# Altium project MAIN_BOARD.PrjPcb (part 1 of 3)
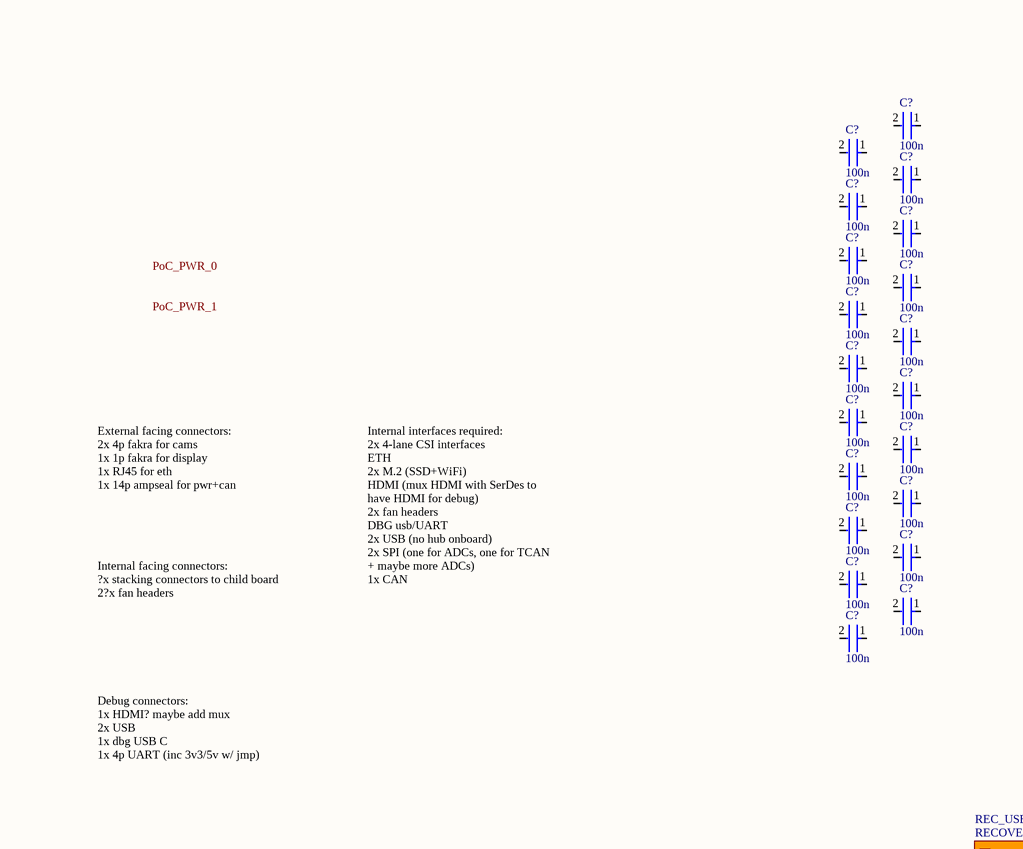
[diagram p0: MAIN_BOARD.SchDoc, top left]
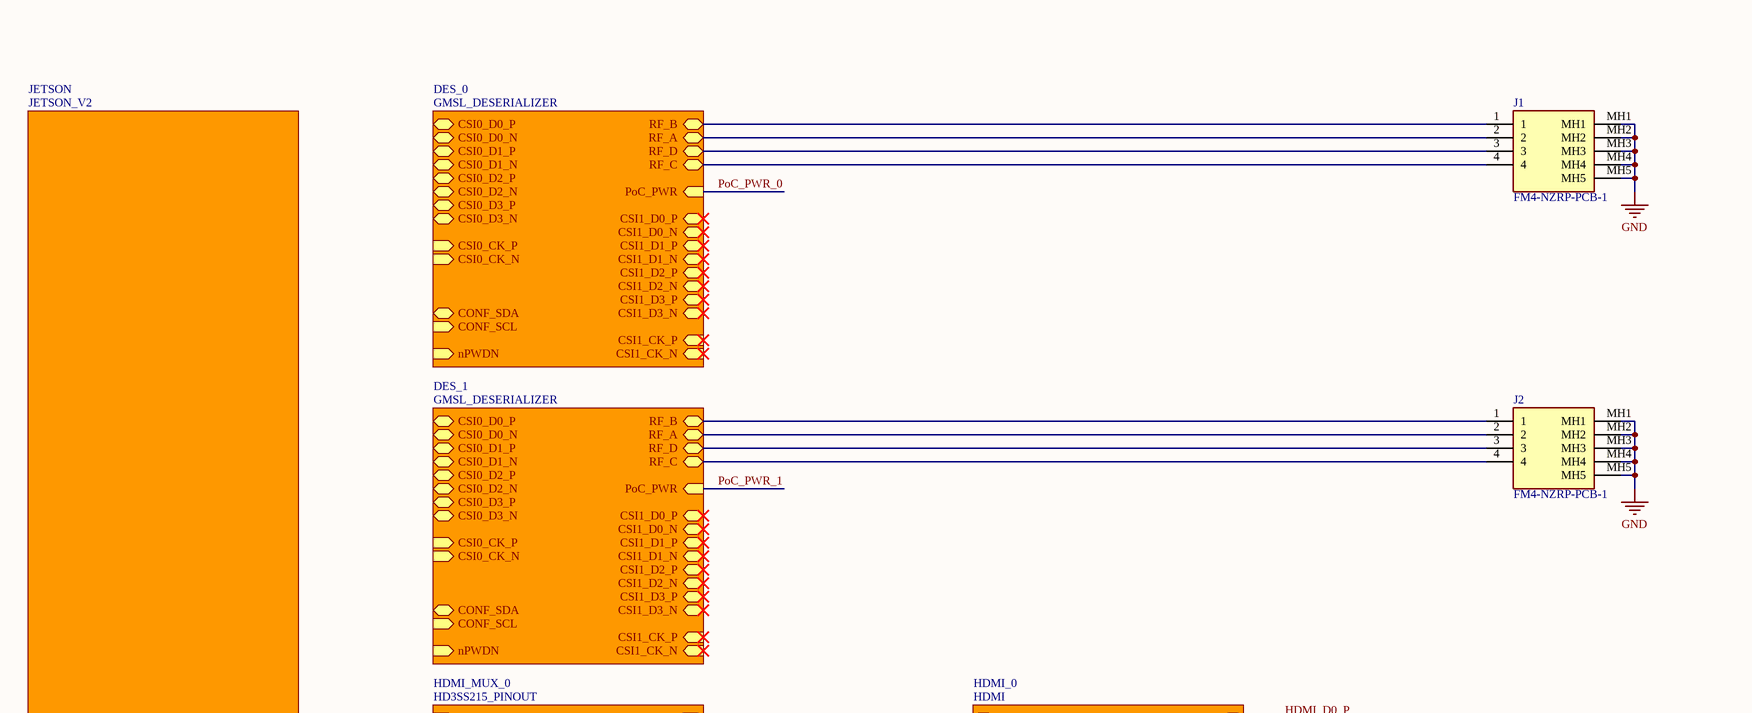
[diagram p1: MAIN_BOARD.SchDoc, top middle]
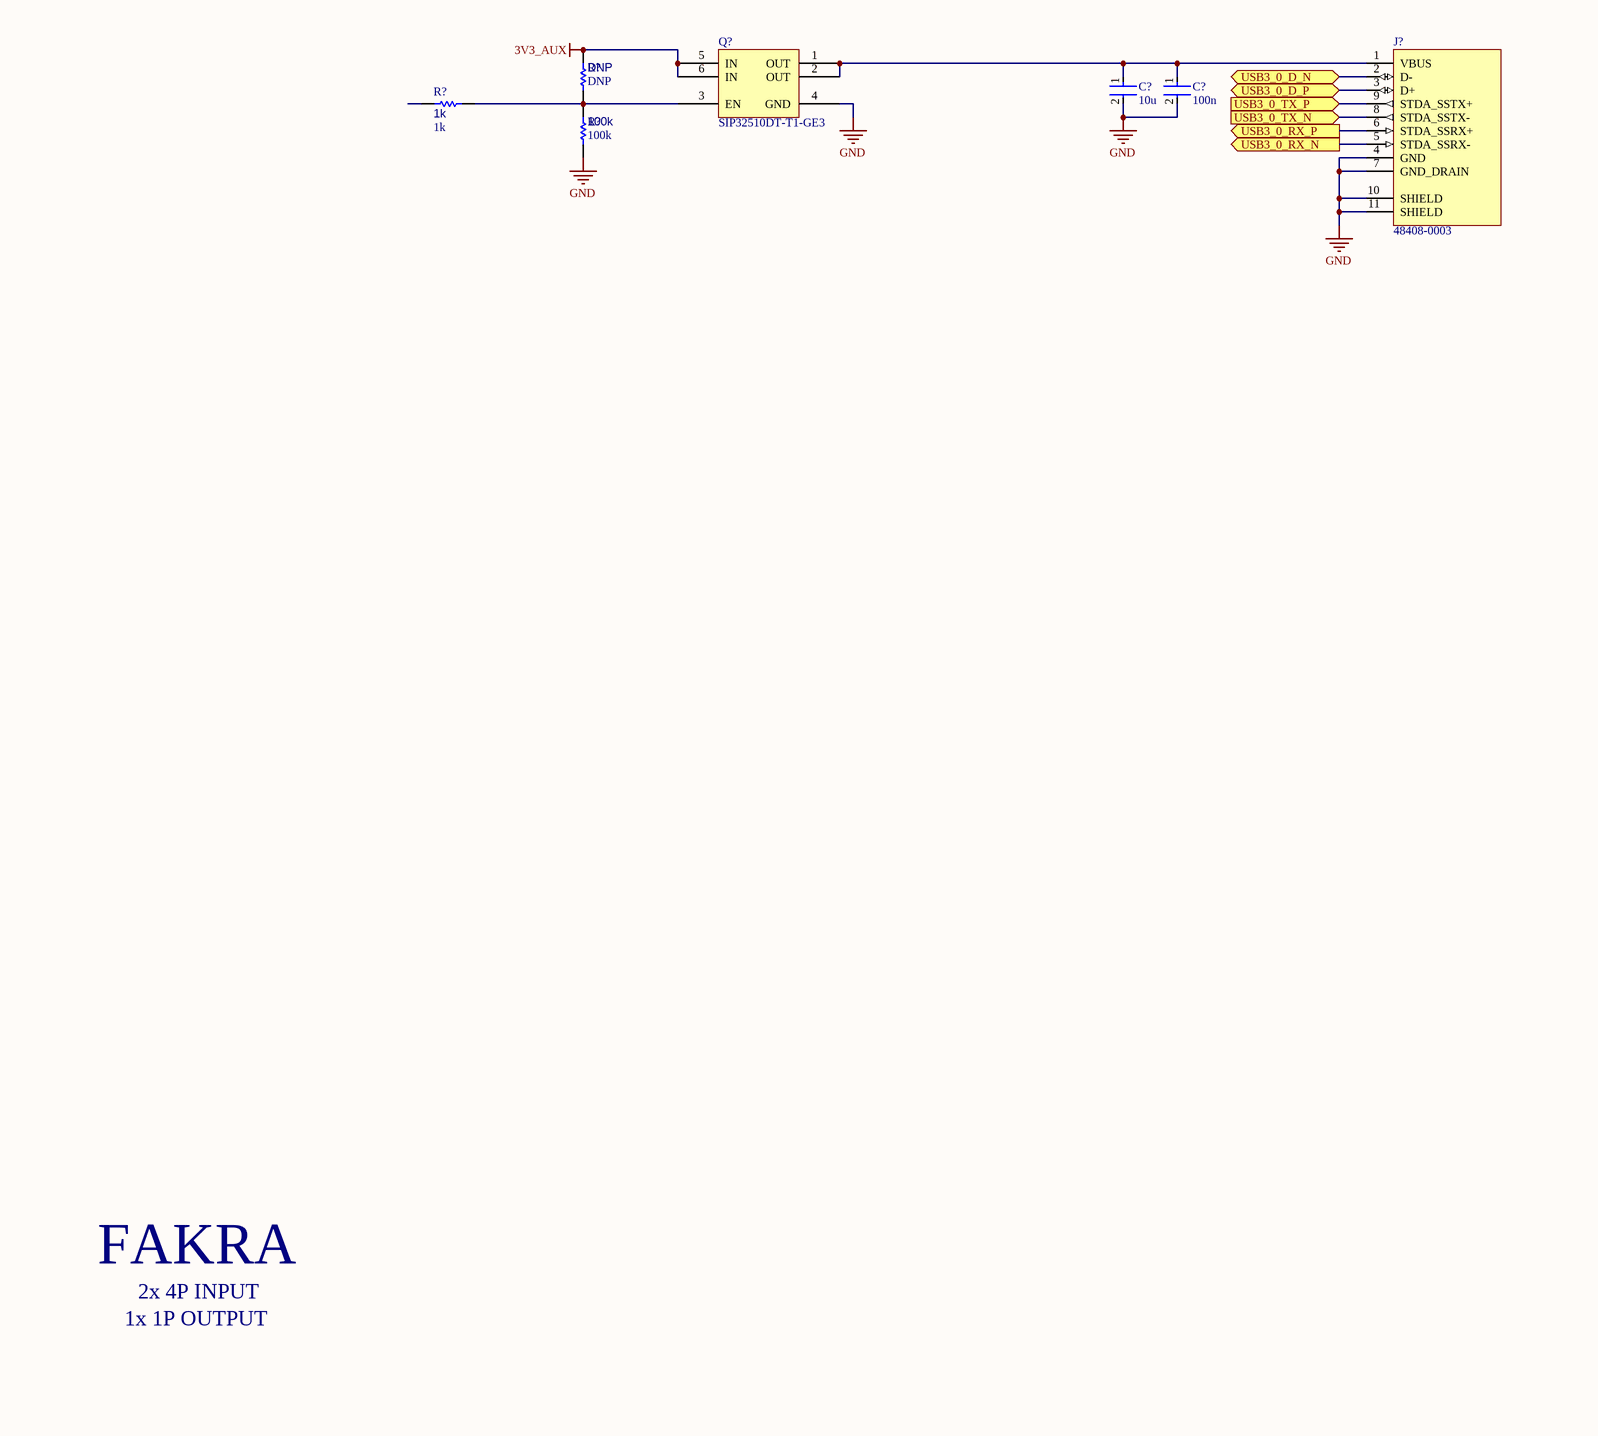
[diagram p2: MAIN_BOARD.SchDoc, top right]
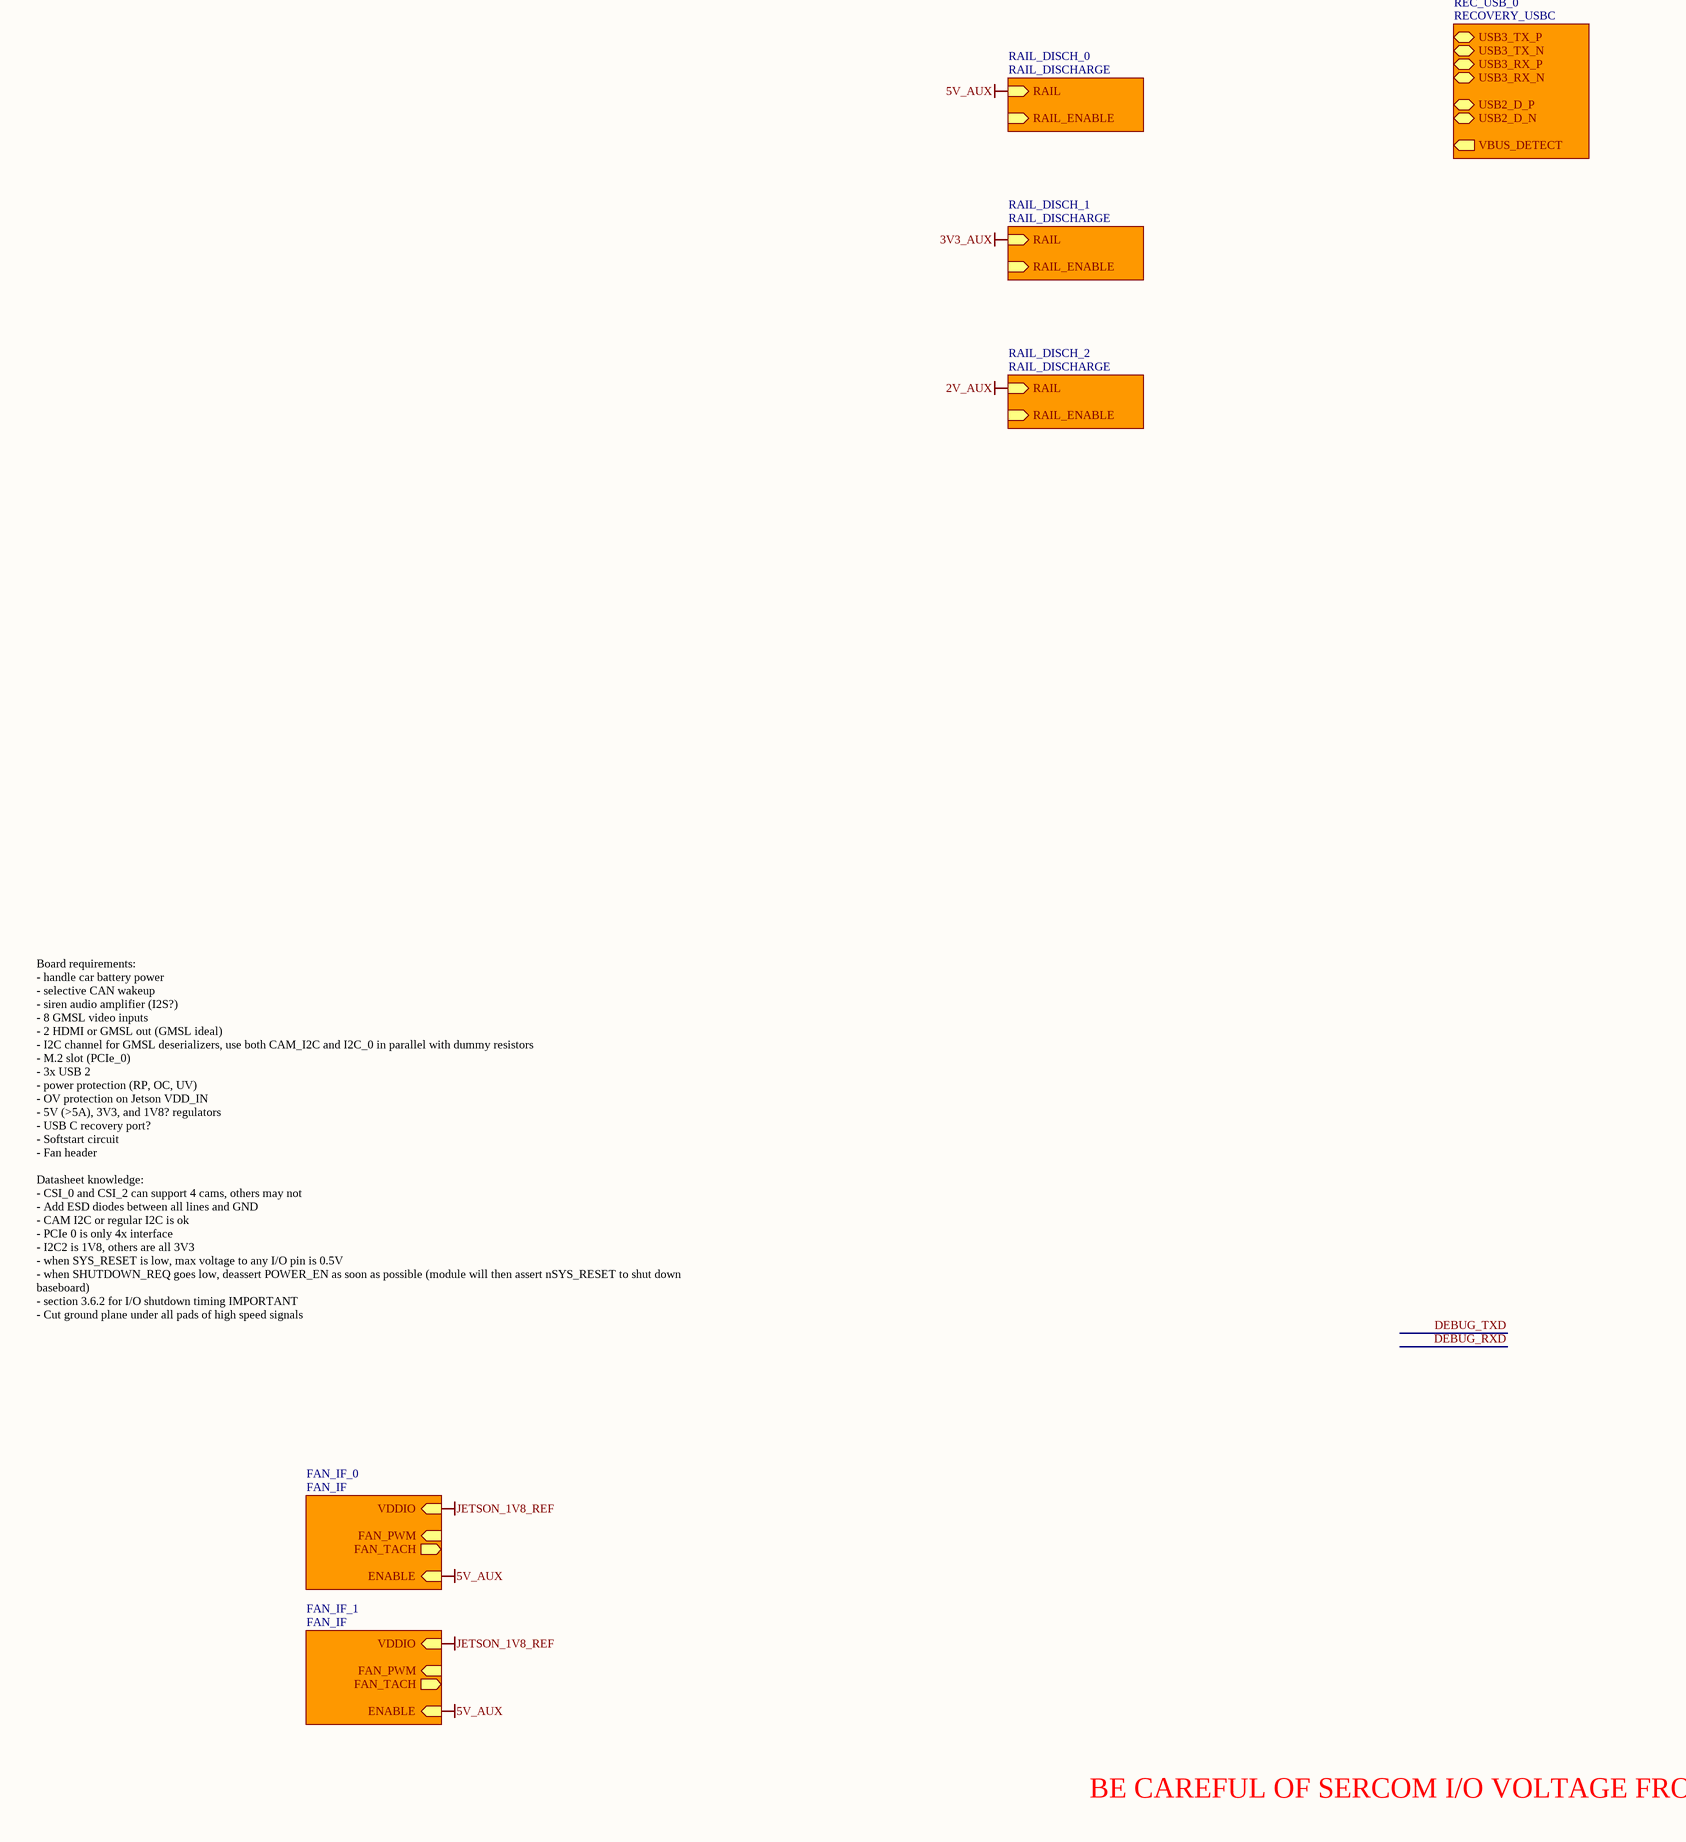
[diagram p3: MAIN_BOARD.SchDoc, bottom left]
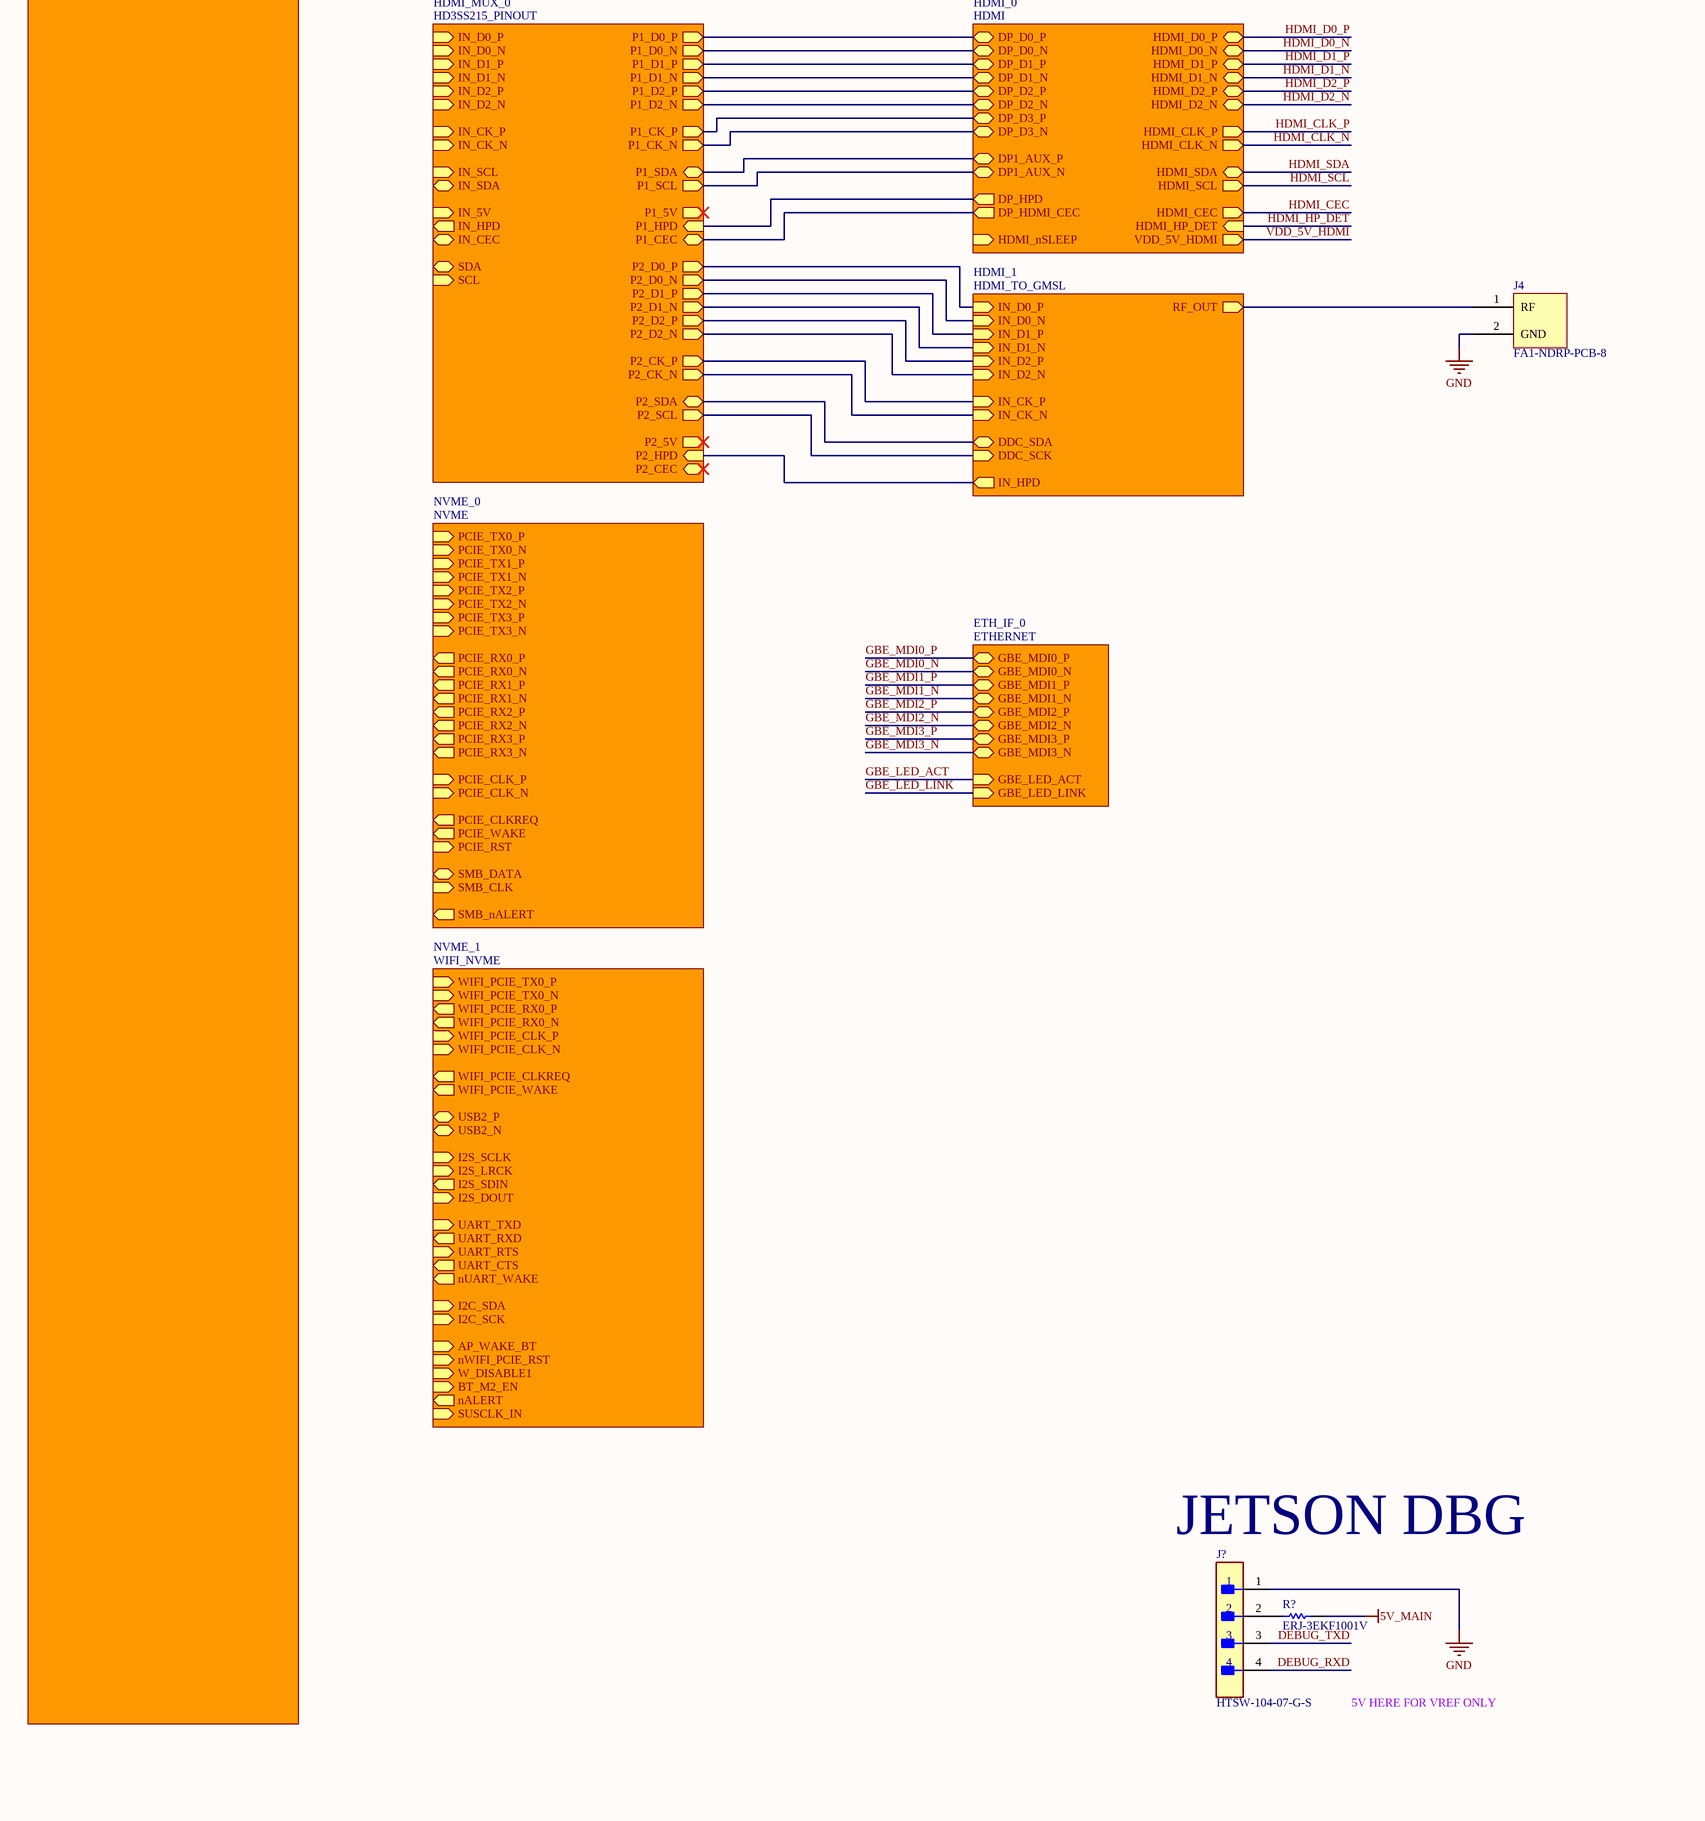
[diagram p4: MAIN_BOARD.SchDoc, bottom middle]
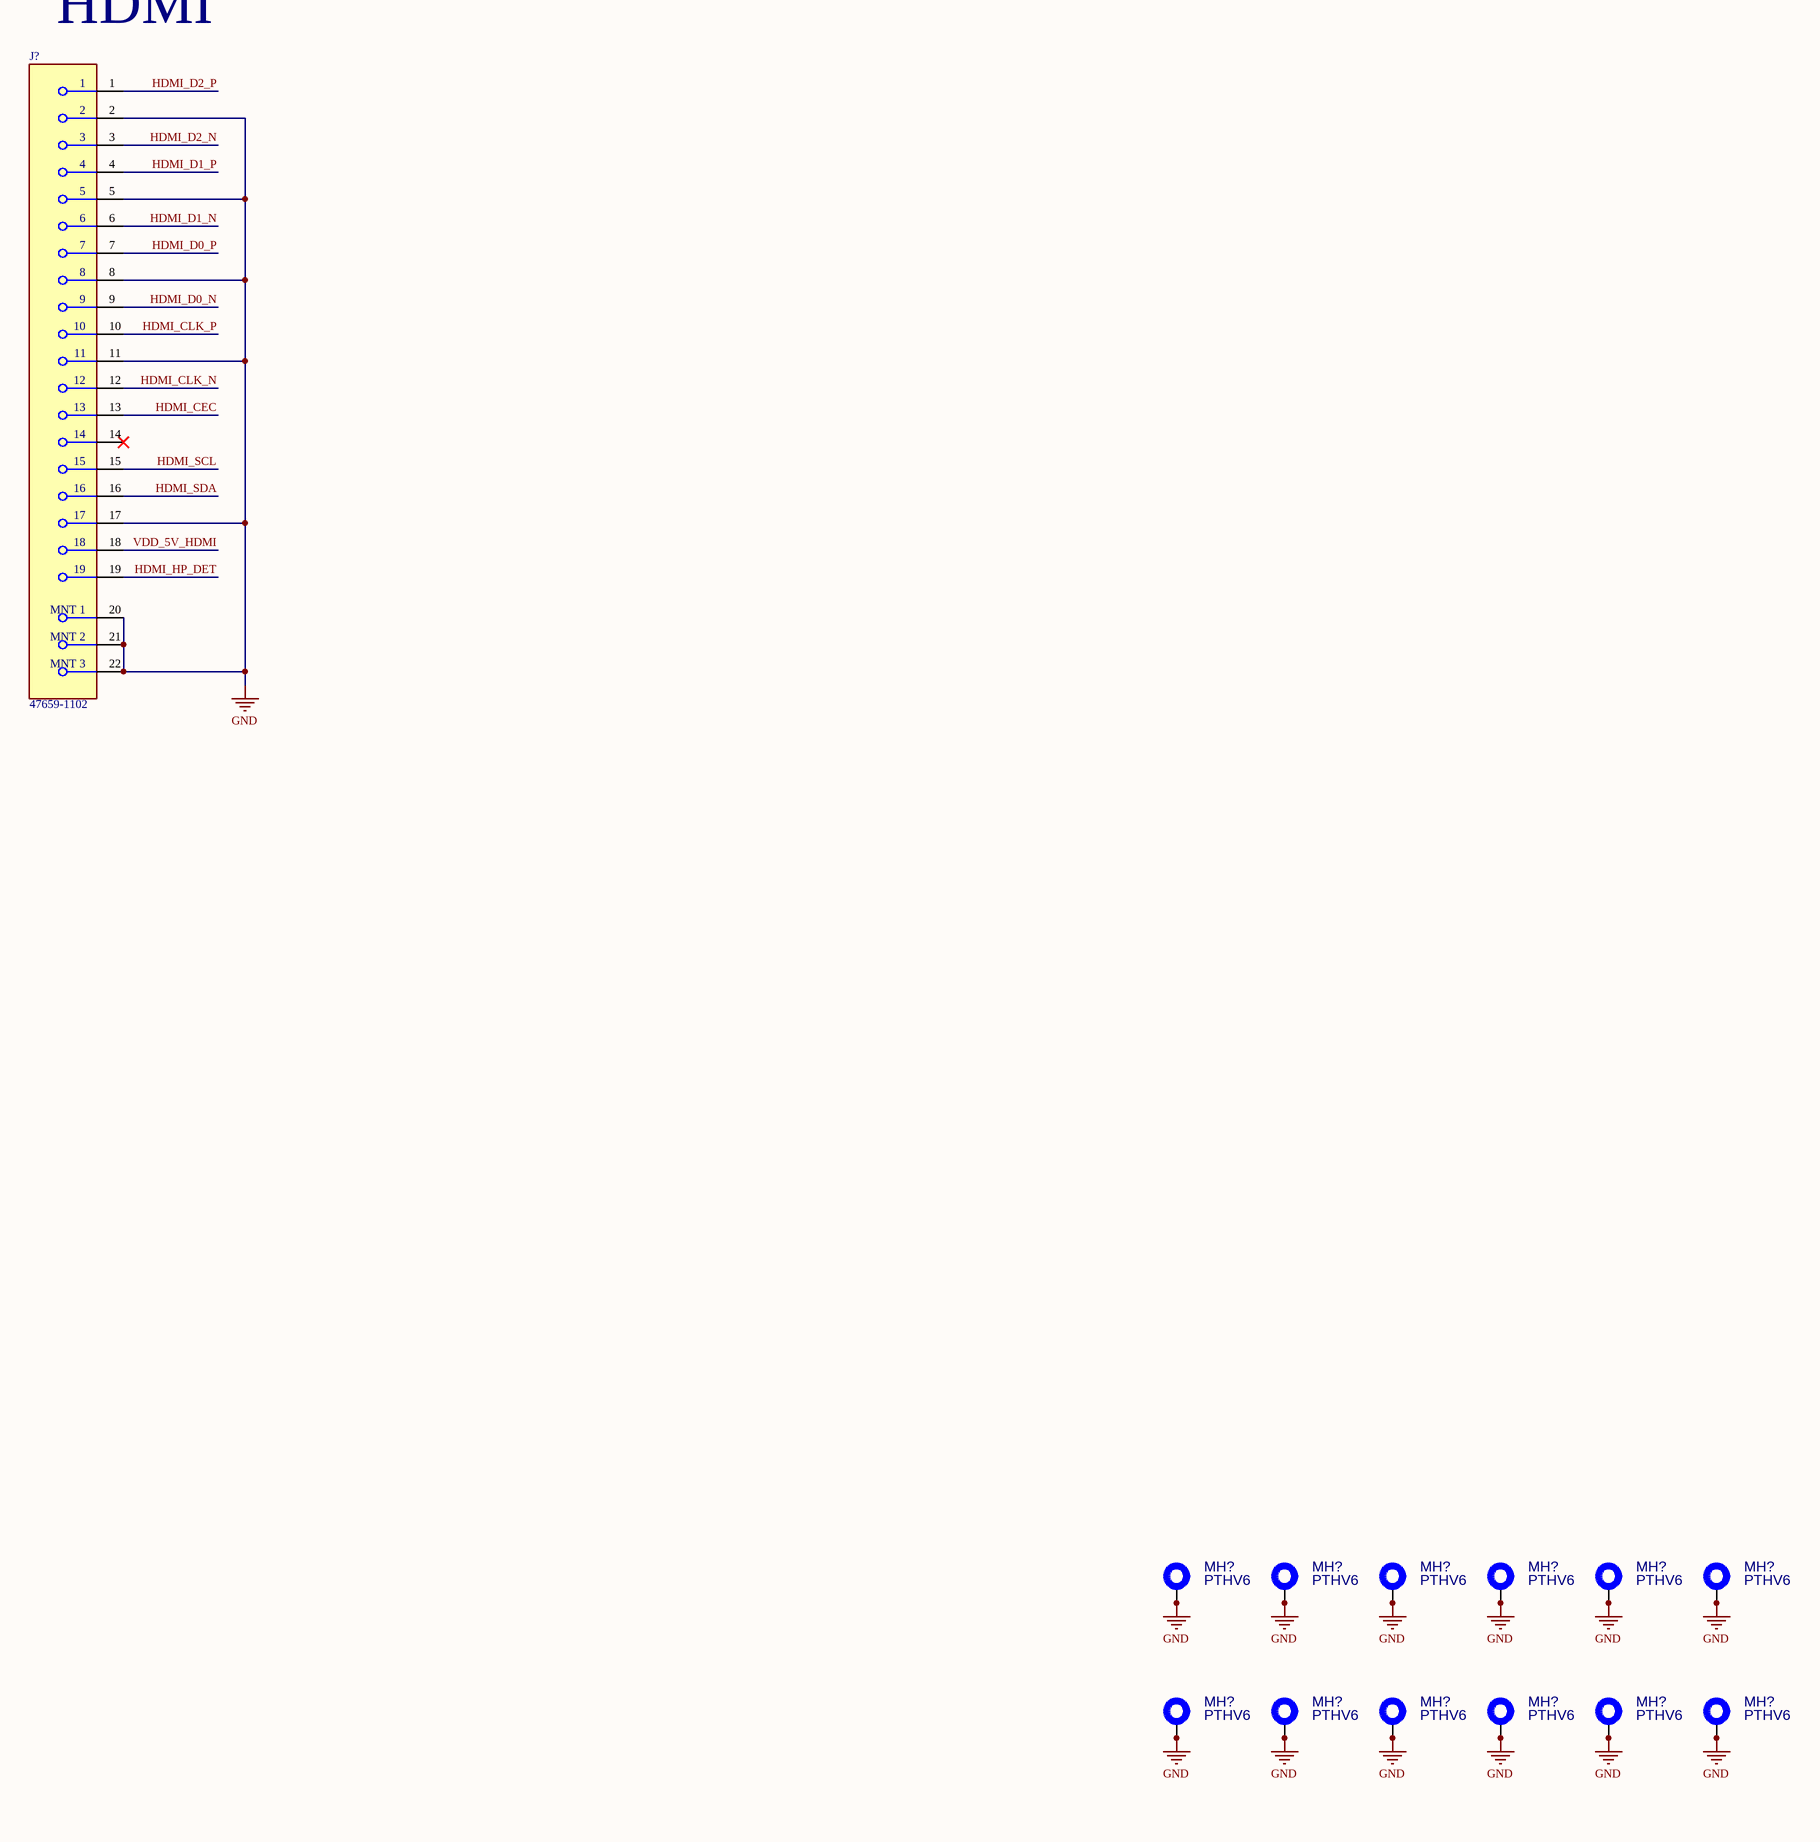
[diagram p5: MAIN_BOARD.SchDoc, bottom right]
8 sheets, 420 parts. Net scope: hierarchical (ports join the sheet entries above them; power ports are global).
Board file: ADAS_ECU_MB_revA.PcbDoc
Sheets:
  MAIN_BOARD.SchDoc
    JETSON = JETSON_V2.SchDoc
    NVME_0 = NVME.SchDoc
    RAIL_DISCH_0 = RAIL_DISCHARGE.SchDoc
    RAIL_DISCH_1 = RAIL_DISCHARGE.SchDoc
    RAIL_DISCH_2 = RAIL_DISCHARGE.SchDoc
    DES_1 = GMSL_DESERIALIZER.SchDoc
    DES_0 = GMSL_DESERIALIZER.SchDoc
    HDMI_1 = HDMI_TO_GMSL.SchDoc
    HDMI_MUX_0 = HD3SS215_PINOUT.SchDoc
  JETSON.SchDoc

## Sheet MAIN_BOARD.SchDoc
size E; SheetNumber: 1; SheetTotal: 13

### Parts
(Parts that share a designator on the sheet are numbered #1, #2 ... from top to bottom, then left to right.)
C?#1  10u  [FP-0402-L_1_0_0_05-W_0_5-IPC_A]
C?#2  100n  [FP-0402-L_1_0_0_05-W_0_5-IPC_A]
C?#3  100n  [FP-0402-L_1_0_0_05-W_0_5-IPC_A]
C?#4  100n  [FP-0402-L_1_0_0_05-W_0_5-IPC_A]
C?#5  100n  [FP-0402-L_1_0_0_05-W_0_5-IPC_A]
C?#6  100n  [FP-0402-L_1_0_0_05-W_0_5-IPC_A]
C?#7  100n  [FP-0402-L_1_0_0_05-W_0_5-IPC_A]
C?#8  100n  [FP-0402-L_1_0_0_05-W_0_5-IPC_A]
C?#9  100n  [FP-0402-L_1_0_0_05-W_0_5-IPC_A]
C?#10  100n  [FP-0402-L_1_0_0_05-W_0_5-IPC_A]
C?#11  100n  [FP-0402-L_1_0_0_05-W_0_5-IPC_A]
C?#12  100n  [FP-0402-L_1_0_0_05-W_0_5-IPC_A]
C?#13  100n  [FP-0402-L_1_0_0_05-W_0_5-IPC_A]
C?#14  100n  [FP-0402-L_1_0_0_05-W_0_5-IPC_A]
C?#15  100n  [FP-0402-L_1_0_0_05-W_0_5-IPC_A]
C?#16  100n  [FP-0402-L_1_0_0_05-W_0_5-IPC_A]
C?#17  100n  [FP-0402-L_1_0_0_05-W_0_5-IPC_A]
C?#18  100n  [FP-0402-L_1_0_0_05-W_0_5-IPC_A]
C?#19  100n  [FP-0402-L_1_0_0_05-W_0_5-IPC_A]
C?#20  100n  [FP-0402-L_1_0_0_05-W_0_5-IPC_A]
C?#21  100n  [FP-0402-L_1_0_0_05-W_0_5-IPC_A]
C?#22  100n  [FP-0402-L_1_0_0_05-W_0_5-IPC_A]
J1  FM4-NZRP-PCB-1  [FM4-NZRP-PCB-1-Footprint-1]
J2  FM4-NZRP-PCB-1  [FM4-NZRP-PCB-1-Footprint-1]
J4  FA1-NDRP-PCB-8  [FA1-NDRP-PCB-8-Footprint-1]
J?#1  48408-0003  [MOLX-48408-0003_V]
J?#2  47659-1102  [FP-47659-1102-MFG]
J?#3  HTSW-104-07-G-S  [FP-HTSW-104-07-G-S-MFG]
MH?#1  PTHV6  [PTHV6 M2]  (net tie, no BOM)
MH?#2  PTHV6  [PTHV6 M2]  (net tie, no BOM)
MH?#3  PTHV6  [PTHV6 M2]  (net tie, no BOM)
MH?#4  PTHV6  [PTHV6 M2]  (net tie, no BOM)
MH?#5  PTHV6  [PTHV6 M2]  (net tie, no BOM)
MH?#6  PTHV6  [PTHV6 M2]  (net tie, no BOM)
MH?#7  PTHV6  [PTHV6 M2]  (net tie, no BOM)
MH?#8  PTHV6  [PTHV6 M2]  (net tie, no BOM)
MH?#9  PTHV6  [PTHV6 M2]  (net tie, no BOM)
MH?#10  PTHV6  [PTHV6 M2]  (net tie, no BOM)
MH?#11  PTHV6  [PTHV6 M2]  (net tie, no BOM)
MH?#12  PTHV6  [PTHV6 M2]  (net tie, no BOM)
Q?#1  SIP32510DT-T1-GE3  [SOT95P284X110-6N]
R?#1  DNP  [R0603B]
R?#2  1k  [R0603B]
R?#3  100k  [R0603B]
R?#4  ERJ-3EKF1001V  [RESC1608X55X30LL15T15]

### Sub-sheets
DES_0 = GMSL_DESERIALIZER: CSI0_D0_P (bidir), CSI0_D0_N (bidir), CSI0_D1_P (bidir), CSI0_D1_N (bidir), CSI0_D2_P (bidir), CSI0_D2_N (bidir), CSI0_D3_P (bidir), CSI0_D3_N (bidir), CSI0_CK_P (in), CSI0_CK_N (in), PoC_PWR (in), RF_B (bidir), RF_A (bidir), RF_C (bidir), RF_D (bidir), CSI1_D0_P (bidir), CSI1_D0_N (bidir), CSI1_D1_P (bidir), CSI1_D1_N (bidir), CSI1_D2_P (bidir), CSI1_D2_N (bidir), CSI1_D3_P (bidir), CSI1_D3_N (bidir), CSI1_CK_P (in), CSI1_CK_N (in), nPWDN (in), CONF_SDA (bidir), CONF_SCL (in)
DES_1 = GMSL_DESERIALIZER: CSI0_D0_P (bidir), CSI0_D0_N (bidir), CSI0_D1_P (bidir), CSI0_D1_N (bidir), CSI0_D2_P (bidir), CSI0_D2_N (bidir), CSI0_D3_P (bidir), CSI0_D3_N (bidir), CSI0_CK_P (in), CSI0_CK_N (in), PoC_PWR (in), RF_B (bidir), RF_A (bidir), RF_C (bidir), RF_D (bidir), CSI1_D0_P (bidir), CSI1_D0_N (bidir), CSI1_D1_P (bidir), CSI1_D1_N (bidir), CSI1_D2_P (bidir), CSI1_D2_N (bidir), CSI1_D3_P (bidir), CSI1_D3_N (bidir), CSI1_CK_P (in), CSI1_CK_N (in), nPWDN (in), CONF_SDA (bidir), CONF_SCL (in)
ETH_IF_0 = ETHERNET (file not in this document): GBE_MDI0_P (bidir), GBE_MDI0_N (bidir), GBE_MDI1_P (bidir), GBE_MDI1_N (bidir), GBE_MDI2_P (bidir), GBE_MDI2_N (bidir), GBE_MDI3_P (bidir), GBE_MDI3_N (bidir), GBE_LED_ACT (in), GBE_LED_LINK (in)
FAN_IF_0 = FAN_IF (file not in this document): FAN_PWM (in), FAN_TACH (out), VDDIO (in), ENABLE (in)
FAN_IF_1 = FAN_IF (file not in this document): FAN_PWM (in), FAN_TACH (out), VDDIO (in), ENABLE (in)
HDMI_0 = HDMI (file not in this document): DP_D0_P (bidir), DP_D0_N (bidir), DP_D1_P (bidir), DP_D1_N (bidir), DP_D2_P (bidir), DP_D2_N (bidir), DP_D3_P (bidir), DP_D3_N (bidir), DP1_AUX_P (bidir), DP1_AUX_N (bidir), DP_HDMI_CEC (out), DP_HPD (out), HDMI_nSLEEP (in), HDMI_D0_P (bidir), HDMI_D0_N (bidir), HDMI_D1_P (bidir), HDMI_D1_N (bidir), HDMI_D2_P (bidir), HDMI_D2_N (bidir), HDMI_CLK_P (out), HDMI_CLK_N (out), HDMI_SDA (bidir), HDMI_SCL (out), HDMI_CEC (out), HDMI_HP_DET (in), VDD_5V_HDMI (out)
HDMI_1 = HDMI_TO_GMSL: IN_D0_P (in), IN_D0_N (in), IN_D1_P (in), IN_D1_N (in), IN_D2_P (in), IN_D2_N (in), IN_CK_N (in), IN_CK_P (in), DDC_SCK (in), DDC_SDA (bidir), IN_HPD (out), RF_OUT (out)
HDMI_MUX_0 = HD3SS215_PINOUT: IN_D0_P (in), IN_D0_N (in), IN_D1_P (in), IN_D1_N (in), IN_D2_P (in), IN_D2_N (in), IN_CK_N (in), IN_CK_P (in), IN_SCL (in), IN_SDA (bidir), IN_5V (in), IN_HPD (out), IN_CEC (bidir), P1_D0_P (out), P1_D0_N (out), P1_D1_P (out), P1_D1_N (out), P1_D2_P (out), P1_D2_N (out), P1_CK_P (out), P1_CK_N (out), P1_SDA (bidir), P1_SCL (out), P1_5V (out), P1_HPD (in), P1_CEC (bidir), P2_D0_P (out), P2_D0_N (out), P2_D1_P (out), P2_D1_N (out), P2_D2_P (out), P2_D2_N (out), P2_CK_P (out), P2_CK_N (out), SDA (bidir), SCL (in), P2_SDA (bidir), P2_SCL (out), P2_5V (out), P2_HPD (in), P2_CEC (bidir)
JETSON = JETSON_V2: no entries
NVME_0 = NVME: SMB_DATA (bidir), SMB_CLK (in), SMB_nALERT (out), PCIE_TX3_N (in), PCIE_TX3_P (in), PCIE_TX2_N (in), PCIE_TX2_P (in), PCIE_TX1_N (in), PCIE_TX1_P (in), PCIE_TX0_N (in), PCIE_TX0_P (in), PCIE_RX3_N (out), PCIE_RX3_P (out), PCIE_RX2_N (out), PCIE_RX2_P (out), PCIE_RX1_N (out), PCIE_RX1_P (out), PCIE_RX0_N (out), PCIE_RX0_P (out), PCIE_CLK_N (in), PCIE_CLK_P (in), PCIE_RST (in), PCIE_CLKREQ (out), PCIE_WAKE (out)
NVME_1 = WIFI_NVME (file not in this document): WIFI_PCIE_TX0_P (in), WIFI_PCIE_TX0_N (in), WIFI_PCIE_RX0_P (out), WIFI_PCIE_RX0_N (out), WIFI_PCIE_CLK_P (in), WIFI_PCIE_CLK_N (in), WIFI_PCIE_CLKREQ (out), WIFI_PCIE_WAKE (out), USB2_P (bidir), USB2_N (bidir), I2S_SCLK (in), I2S_LRCK (in), I2S_SDIN (out), I2S_DOUT (in), nUART_WAKE (out), UART_RXD (out), UART_TXD (in), UART_RTS (in), UART_CTS (out), AP_WAKE_BT (in), SUSCLK_IN (in), I2C_SCK (in), I2C_SDA (in), nALERT (out), nWIFI_PCIE_RST (in), W_DISABLE1 (in), BT_M2_EN (in)
RAIL_DISCH_0 = RAIL_DISCHARGE: RAIL (in), RAIL_ENABLE (in)
RAIL_DISCH_1 = RAIL_DISCHARGE: RAIL (in), RAIL_ENABLE (in)
RAIL_DISCH_2 = RAIL_DISCHARGE: RAIL (in), RAIL_ENABLE (in)
REC_USB_0 = RECOVERY_USBC (file not in this document): VBUS_DETECT (out), USB3_TX_P (bidir), USB3_TX_N (bidir), USB3_RX_P (bidir), USB3_RX_N (bidir), USB2_D_P (bidir), USB2_D_N (bidir)

### Ports
USB3_0_D_N (bidir), USB3_0_D_P (bidir), USB3_0_RX_N (out), USB3_0_RX_P (out), USB3_0_TX_N (in), USB3_0_TX_P (in)

### Nets
3V3_AUX: Q?#1.5(IN) Q?#1.6(IN) R?#1.2 ; sheet RAIL_DISCH_1/RAIL  [project net RAIL]
5V_AUX: sheet FAN_IF_0/ENABLE, sheet FAN_IF_1/ENABLE, sheet RAIL_DISCH_0/RAIL  [project net RAIL_RAIL_DISCH_0]
5V_MAIN: R?#4.1
GND: C?#1.2 C?#2.2 J1.MH1 J1.MH2 J1.MH3 J1.MH4 J1.MH5 J2.MH1 J2.MH2 J2.MH3 J2.MH4 J2.MH5 J4.2(GND) J?#1.4(GND) J?#1.7(GND_DRAIN) J?#1.10(SHIELD) J?#1.11(SHIELD) J?#2.2 J?#2.5 J?#2.8 J?#2.11 J?#2.17 J?#2.20(MNT_1) J?#2.21(MNT_2) J?#2.22(MNT_3) J?#3.1 MH?#1.1(MH) MH?#1.2(V1) MH?#1.3(V2) MH?#1.4(V3) MH?#1.5(V4) MH?#1.6(V5) MH?#1.7(V6) MH?#2.1(MH) MH?#2.2(V1) MH?#2.3(V2) MH?#2.4(V3) MH?#2.5(V4) MH?#2.6(V5) MH?#2.7(V6) MH?#3.1(MH) MH?#3.2(V1) MH?#3.3(V2) MH?#3.4(V3) MH?#3.5(V4) MH?#3.6(V5) MH?#3.7(V6) MH?#4.1(MH) MH?#4.2(V1) MH?#4.3(V2) MH?#4.4(V3) MH?#4.5(V4) MH?#4.6(V5) MH?#4.7(V6) MH?#5.1(MH) MH?#5.2(V1) MH?#5.3(V2) MH?#5.4(V3) MH?#5.5(V4) MH?#5.6(V5) MH?#5.7(V6) MH?#6.1(MH) MH?#6.2(V1) MH?#6.3(V2) MH?#6.4(V3) MH?#6.5(V4) MH?#6.6(V5) MH?#6.7(V6) MH?#7.1(MH) MH?#7.2(V1) MH?#7.3(V2) MH?#7.4(V3) MH?#7.5(V4) MH?#7.6(V5) MH?#7.7(V6) MH?#8.1(MH) MH?#8.2(V1) MH?#8.3(V2) MH?#8.4(V3) MH?#8.5(V4) MH?#8.6(V5) MH?#8.7(V6) MH?#9.1(MH) MH?#9.2(V1) MH?#9.3(V2) MH?#9.4(V3) MH?#9.5(V4) MH?#9.6(V5) MH?#9.7(V6) MH?#10.1(MH) MH?#10.2(V1) MH?#10.3(V2) MH?#10.4(V3) MH?#10.5(V4) MH?#10.6(V5) MH?#10.7(V6) MH?#11.1(MH) MH?#11.2(V1) MH?#11.3(V2) MH?#11.4(V3) MH?#11.5(V4) MH?#11.6(V5) MH?#11.7(V6) MH?#12.1(MH) MH?#12.2(V1) MH?#12.3(V2) MH?#12.4(V3) MH?#12.5(V4) MH?#12.6(V5) MH?#12.7(V6) Q?#1.4(GND) R?#3.1
JETSON_1V8_REF: sheet FAN_IF_0/VDDIO, sheet FAN_IF_1/VDDIO
DEBUG_RXD: J?#3.4
DEBUG_TXD: J?#3.3
GBE_LED_ACT: sheet ETH_IF_0/GBE_LED_ACT
GBE_LED_LINK: sheet ETH_IF_0/GBE_LED_LINK
GBE_MDI0_N: sheet ETH_IF_0/GBE_MDI0_N
GBE_MDI0_P: sheet ETH_IF_0/GBE_MDI0_P
GBE_MDI1_N: sheet ETH_IF_0/GBE_MDI1_N
GBE_MDI1_P: sheet ETH_IF_0/GBE_MDI1_P
GBE_MDI2_N: sheet ETH_IF_0/GBE_MDI2_N
GBE_MDI2_P: sheet ETH_IF_0/GBE_MDI2_P
GBE_MDI3_N: sheet ETH_IF_0/GBE_MDI3_N
GBE_MDI3_P: sheet ETH_IF_0/GBE_MDI3_P
HDMI_CEC: J?#2.13 ; sheet HDMI_0/HDMI_CEC
HDMI_CLK_N: J?#2.12 ; sheet HDMI_0/HDMI_CLK_N
HDMI_CLK_P: J?#2.10 ; sheet HDMI_0/HDMI_CLK_P
HDMI_D0_N: J?#2.9 ; sheet HDMI_0/HDMI_D0_N
HDMI_D0_P: J?#2.7 ; sheet HDMI_0/HDMI_D0_P
HDMI_D1_N: J?#2.6 ; sheet HDMI_0/HDMI_D1_N
HDMI_D1_P: J?#2.4 ; sheet HDMI_0/HDMI_D1_P
HDMI_D2_N: J?#2.3 ; sheet HDMI_0/HDMI_D2_N
HDMI_D2_P: J?#2.1 ; sheet HDMI_0/HDMI_D2_P
HDMI_HP_DET: J?#2.19 ; sheet HDMI_0/HDMI_HP_DET
HDMI_SCL: J?#2.15 ; sheet HDMI_0/HDMI_SCL
HDMI_SDA: J?#2.16 ; sheet HDMI_0/HDMI_SDA
P1_CK_N: sheet HDMI_0/DP_D3_N, sheet HDMI_MUX_0/P1_CK_N
P1_CK_P: sheet HDMI_0/DP_D3_P, sheet HDMI_MUX_0/P1_CK_P
P1_D0_N: sheet HDMI_0/DP_D0_N, sheet HDMI_MUX_0/P1_D0_N
P1_D0_P: sheet HDMI_0/DP_D0_P, sheet HDMI_MUX_0/P1_D0_P
P1_D1_N: sheet HDMI_0/DP_D1_N, sheet HDMI_MUX_0/P1_D1_N
P1_D1_P: sheet HDMI_0/DP_D1_P, sheet HDMI_MUX_0/P1_D1_P
P1_D2_N: sheet HDMI_0/DP_D2_N, sheet HDMI_MUX_0/P1_D2_N
P1_D2_P: sheet HDMI_0/DP_D2_P, sheet HDMI_MUX_0/P1_D2_P
P2_CK_N: sheet HDMI_1/IN_CK_N, sheet HDMI_MUX_0/P2_CK_N
P2_CK_P: sheet HDMI_1/IN_CK_P, sheet HDMI_MUX_0/P2_CK_P
P2_D0_N: sheet HDMI_1/IN_D0_N, sheet HDMI_MUX_0/P2_D0_N
P2_D0_P: sheet HDMI_1/IN_D0_P, sheet HDMI_MUX_0/P2_D0_P
P2_D1_N: sheet HDMI_1/IN_D1_N, sheet HDMI_MUX_0/P2_D1_N
P2_D1_P: sheet HDMI_1/IN_D1_P, sheet HDMI_MUX_0/P2_D1_P
P2_D2_N: sheet HDMI_1/IN_D2_N, sheet HDMI_MUX_0/P2_D2_N
P2_D2_P: sheet HDMI_1/IN_D2_P, sheet HDMI_MUX_0/P2_D2_P
PoC_A: J2.2 ; sheet DES_1/RF_A
PoC_A: J1.2 ; sheet DES_0/RF_A  [a separate net that carries the same name]
PoC_B: J2.1 ; sheet DES_1/RF_B
PoC_B: J1.1 ; sheet DES_0/RF_B  [a separate net that carries the same name]
PoC_C: J2.4 ; sheet DES_1/RF_C
PoC_C: J1.4 ; sheet DES_0/RF_C  [a separate net that carries the same name]
PoC_D: J2.3 ; sheet DES_1/RF_D
PoC_D: J1.3 ; sheet DES_0/RF_D  [a separate net that carries the same name]
VDD_5V_HDMI: J?#2.18 ; sheet HDMI_0/VDD_5V_HDMI
NetC?#1_1: C?#1.1 C?#2.1 J?#1.1(VBUS) Q?#1.1(OUT) Q?#1.2(OUT)
NetJ4_1: J4.1(RF) ; sheet HDMI_1/RF_OUT
NetJ?#1_2: J?#1.2(D-) ; port USB3_0_D_N
NetJ?#1_3: J?#1.3(D+) ; port USB3_0_D_P
NetJ?#1_5: J?#1.5(STDA_SSRX-) ; port USB3_0_RX_N
NetJ?#1_6: J?#1.6(STDA_SSRX+) ; port USB3_0_RX_P
NetJ?#1_8: J?#1.8(STDA_SSTX-) ; port USB3_0_TX_N
NetJ?#1_9: J?#1.9(STDA_SSTX+) ; port USB3_0_TX_P
NetJ?#3_2: J?#3.2 R?#4.2
NetQ?#1_3: Q?#1.3(EN) R?#1.1 R?#2.1 R?#3.2
(unnamed): sheet HDMI_0/DP1_AUX_P, sheet HDMI_MUX_0/P1_SDA
(unnamed): sheet HDMI_0/DP1_AUX_N, sheet HDMI_MUX_0/P1_SCL
(unnamed): sheet HDMI_0/DP_HDMI_CEC, sheet HDMI_MUX_0/P1_CEC
(unnamed): sheet HDMI_0/DP_HPD, sheet HDMI_MUX_0/P1_HPD
(unnamed): sheet HDMI_1/DDC_SCK, sheet HDMI_MUX_0/P2_SCL
(unnamed): sheet HDMI_1/DDC_SDA, sheet HDMI_MUX_0/P2_SDA
(unnamed): sheet HDMI_1/IN_HPD, sheet HDMI_MUX_0/P2_HPD

Not connected (* = marked no-connect by the designer): C?#3 1 2; C?#4 1 2; C?#5 1 2; C?#6 1 2; C?#7 1 2; C?#8 1 2; C?#9 1 2; C?#10 1 2; C?#11 1 2; C?#12 1 2; C?#13 1 2; C?#14 1 2; C?#15 1 2; C?#16 1 2; C?#17 1 2; C?#18 1 2; C?#19 1 2; C?#20 1 2; C?#21 1 2; C?#22 1 2; J?#2 14*; R?#2 2

### Notes on the sheet
- FAKRA
- 2x 4P INPUT
- 1x 1P OUTPUT
- External facing connectors:
  2x 4p fakra for cams
  1x 1p fakra for display
  1x RJ45 for eth
  1x 14p ampseal for pwr+can
- Internal facing connectors:
  ?x stacking connectors to child board
  2?x fan headers
- HDMI
- Internal interfaces required:
  2x 4-lane CSI interfaces
  ETH
  2x M.2 (SSD+WiFi)
  HDMI (mux HDMI with SerDes to have HDMI for debug)
  2x fan headers
  DBG usb/UART
  2x USB (no hub onboard)
  2x SPI (one for ADCs, one for TCAN + maybe more ADCs)
  1x CAN
- Debug connectors:
  1x HDMI? maybe add mux
  2x USB
  1x dbg USB C
  1x 4p UART (inc 3v3/5v w/ jmp)
- Board requirements:
  - handle car battery power
  - selective CAN wakeup
  - siren audio amplifier (I2S?)
  - 8 GMSL video inputs
  - 2 HDMI or GMSL out (GMSL ideal)
  - I2C channel for GMSL deserializers, use both CAM_I2C and I2C_0 in parallel with dummy resistors
  - M.2 slot (PCIe_0)
  - 3x USB 2
  - power protection (RP, OC, UV)
  - OV protection on Jetson VDD_IN
  - 5V (>5A), 3V3, and 1V8? regulators
  - USB C recovery port?
  - Softstart circuit
  - Fan header
  Datasheet knowledge:
  - CSI_0 and CSI_2 can support 4 cams, others may not
  - Add ESD diodes between all lines and GND
  - CAM I2C or regular I2C is ok
  - PCIe 0 is only 4x interface
  - I2C2 is 1V8, others are all 3V3
  - when SYS_RESET is low, max voltage to any I/O pin is 0.5V
  - when SHUTDOWN_REQ goes low, deassert POWER_EN as soon as possible (module will then assert nSYS_RESET to shut down baseboard)
  - section 3.6.2 for I/O shutdown timing IMPORTANT
  - Cut ground plane under all pads of high speed signals
- (near J?#3) JETSON DBG
- 5V HERE FOR VREF ONLY
- BE CAREFUL OF SERCOM I/O VOLTAGE FROM JETSON
- Labels drawn without touching a wire or pin: PoC_PWR_0, PoC_PWR_1

### Library data of the parts
C?#1-C?#22 = CMP-001-00058-1: LARGE PADS, 0402 CAP, CHANGE COMMENT TO MATCH REAL P/N; Capacitor Type: Ceramic; Min Operating Temperature: -55°C; Mounting Technology: Surface Mount; Pins: 2; Case/Package: 0402; RoHS Compliant: Yes; Max Operating Temperature: 85°C
J1 J2 = CMP-002-00044-4: Connector RF Mini-FAKRA Plug 9GHz 50Ohm Solder Right Angle Through Hole; Source: fakra4ch.SchLib; Component Type: Standard; Pins: 9; Design Item ID: CMP-002-00085-1
J4 = CMP-002-00054-1: RF F Connector, Male, Board Mount, Solder Terminal, Plug; Connector Type: RF F CONNECTOR; RoHS Compliant: Yes; Mounting Technology: Board
J?#1 = CMP-0411-00003-1: Universal Serial Bus (USB 3.0) I/O Connector, Vertical, Type A, Through Hole, 9 Circuits, -20 to 85 degC, RoHS, Tray; No. of Positions: 9; No. of Rows: 2; Packing: Tray; Orientation: Vertical; ComponentLink3Description: Package Specification; ComponentLink2URL: http://www.molex.com/webdocs/datasheets/pdf/en-us/0484080003_IO_CONNECTORS.pdf; ComponentLink3URL: http://www.molex.com/pdm_docs/sd/484080003_sd.pdf; ComponentLink1Description: Manufacturer URL; PackageVersion: Rev. F, 12/2012; Mounting Technology: Through Hole; Temperature Min: -20 degC; ComponentLink2Description: Datasheet; PackageDescription: 9-Pin USB 3.0 I/O Receptacle, Vertical, Height 15.25 mm, Through Hole; PartNumber: 48408-0003; Temperature Max: 85 degC; RoHS: TRUE; ComponentLink1URL: http://www.molex.com/
J?#2 = CMP-04768-000010-1: HDMI REC.VERTICAL SMT TYPE W/HEI; RoHS Compliant: Yes
J?#3 = CMP-02766-001776-1: CONN HEADER VERT 4POS 2.54MM; Gender: Male; Number of Contacts: 4; Packaging: Bulk; RoHS Compliant: Yes; Number of Rows: 1; Mount: Through Hole; Contact Material: Bronze; Series: HTSW; Radiation Hardening: No; Pitch: 2.54mm; Reach SVHC Compliant: Yes; Contact Plating: Gold; Termination: Through Hole
MH?#1-MH?#12 = CMP-00028-00001-11: Plated mounting hole with 6 peripheral vias. This is a generic symbol that groups all relevant footprints.
Q?#1 = CMP-019-00054-1: Power Switch ICs – Power Distribution; VISHAY; SIP32510DT-T1-GE3; 1; 1; 5.5 V; SOT-23-6; Max Supply Voltage: 5.5V; Max Power Dissipation: 833mW; Min Supply Voltage: 1.2V; Case/Package: SOT-23-6; Mounting Technology: Surface Mount; Max Operating Temperature: 85°C; Min Operating Temperature: -40°C
R?#1-R?#3 = CMP-009-00002-14: Resistor
  R?#1: Value: DNP
  R?#2: Value: 1k
  R?#3: Value: 100k
R?#4 = CMP-2000-00180-1: Manufacturer: Panasonic; Part Number: ERJ-3EKF1001V

## Sheet JETSON_V2.SchDoc
size D; SheetNumber: 11; SheetTotal: 15
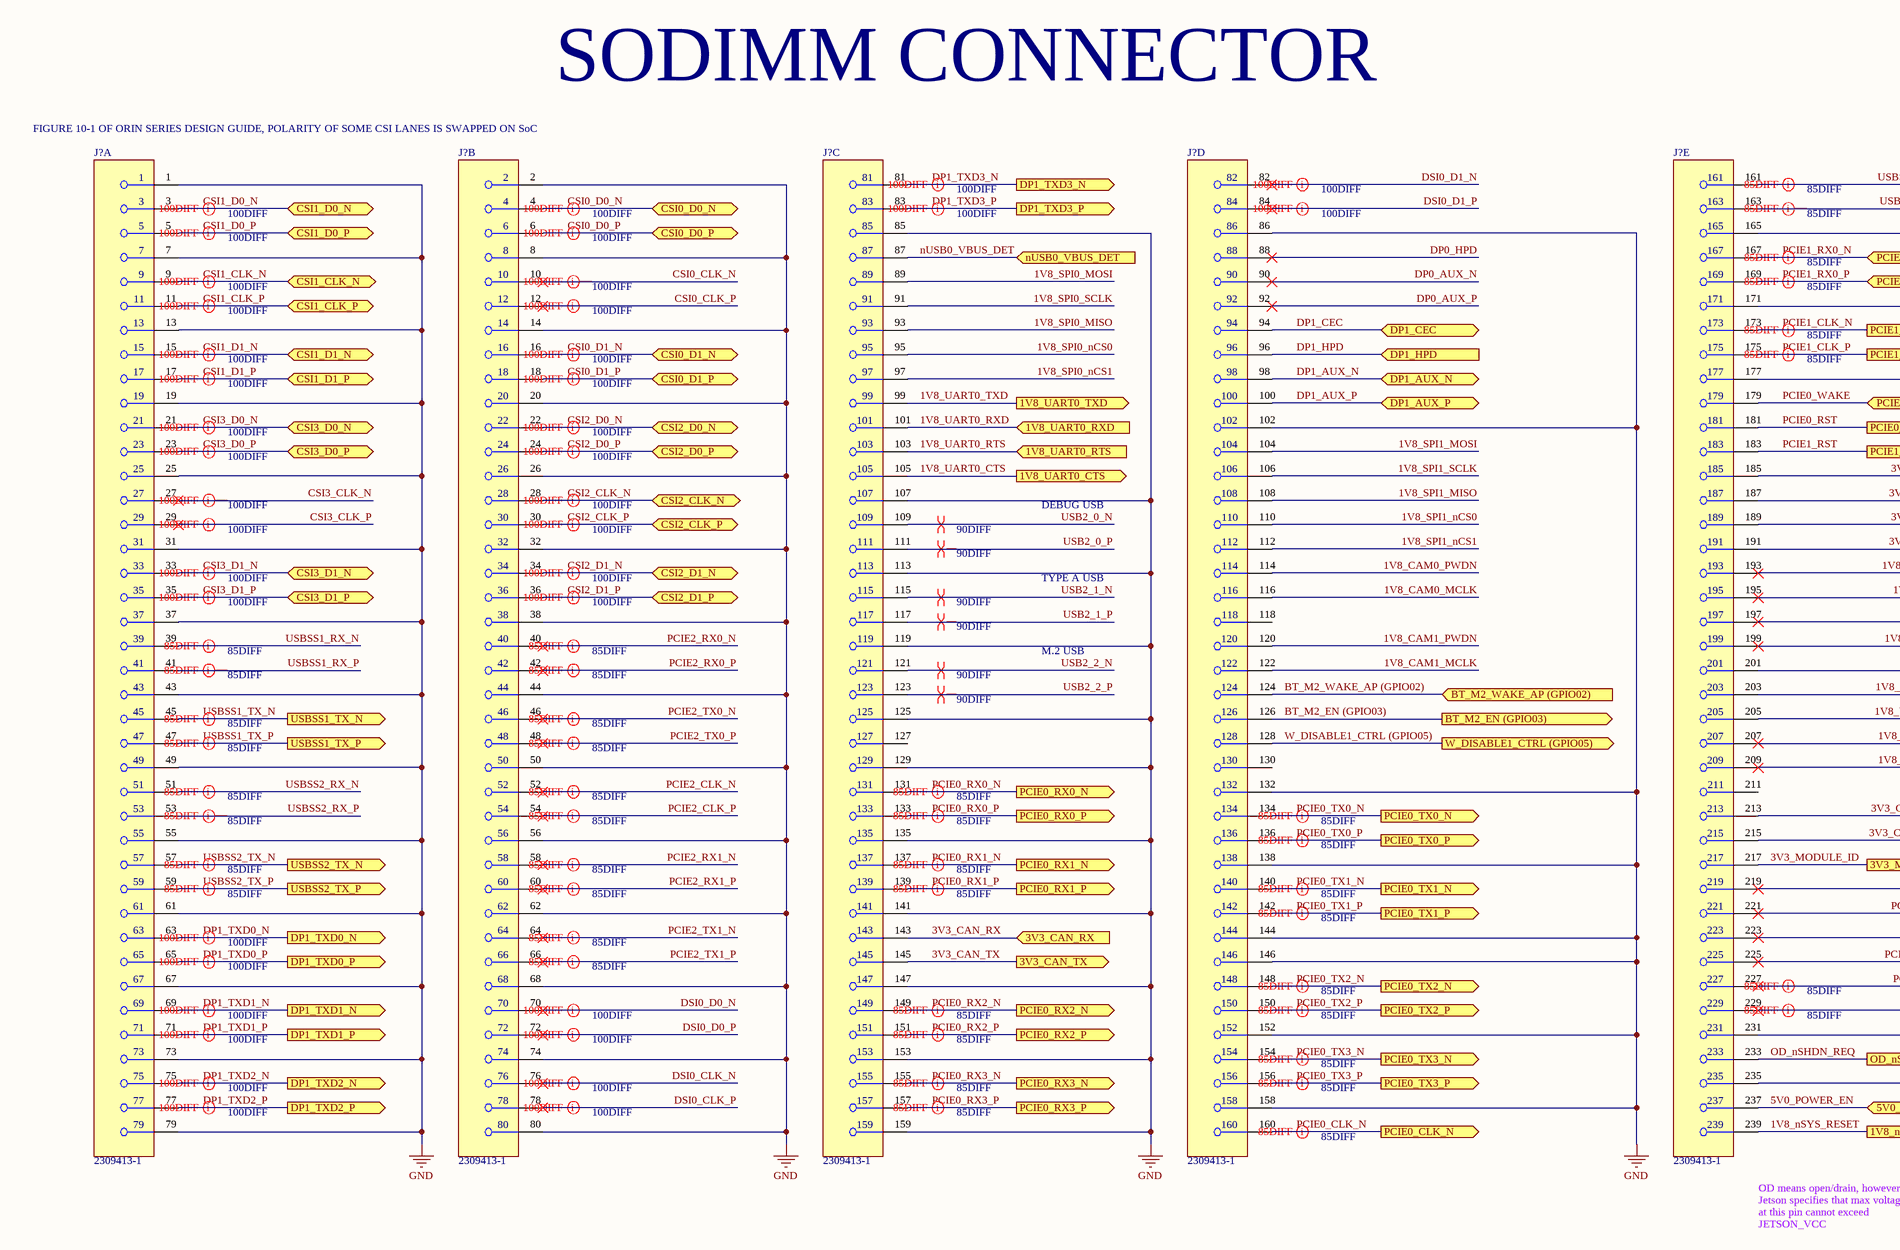
[diagram p6: JETSON_V2.SchDoc, top left]
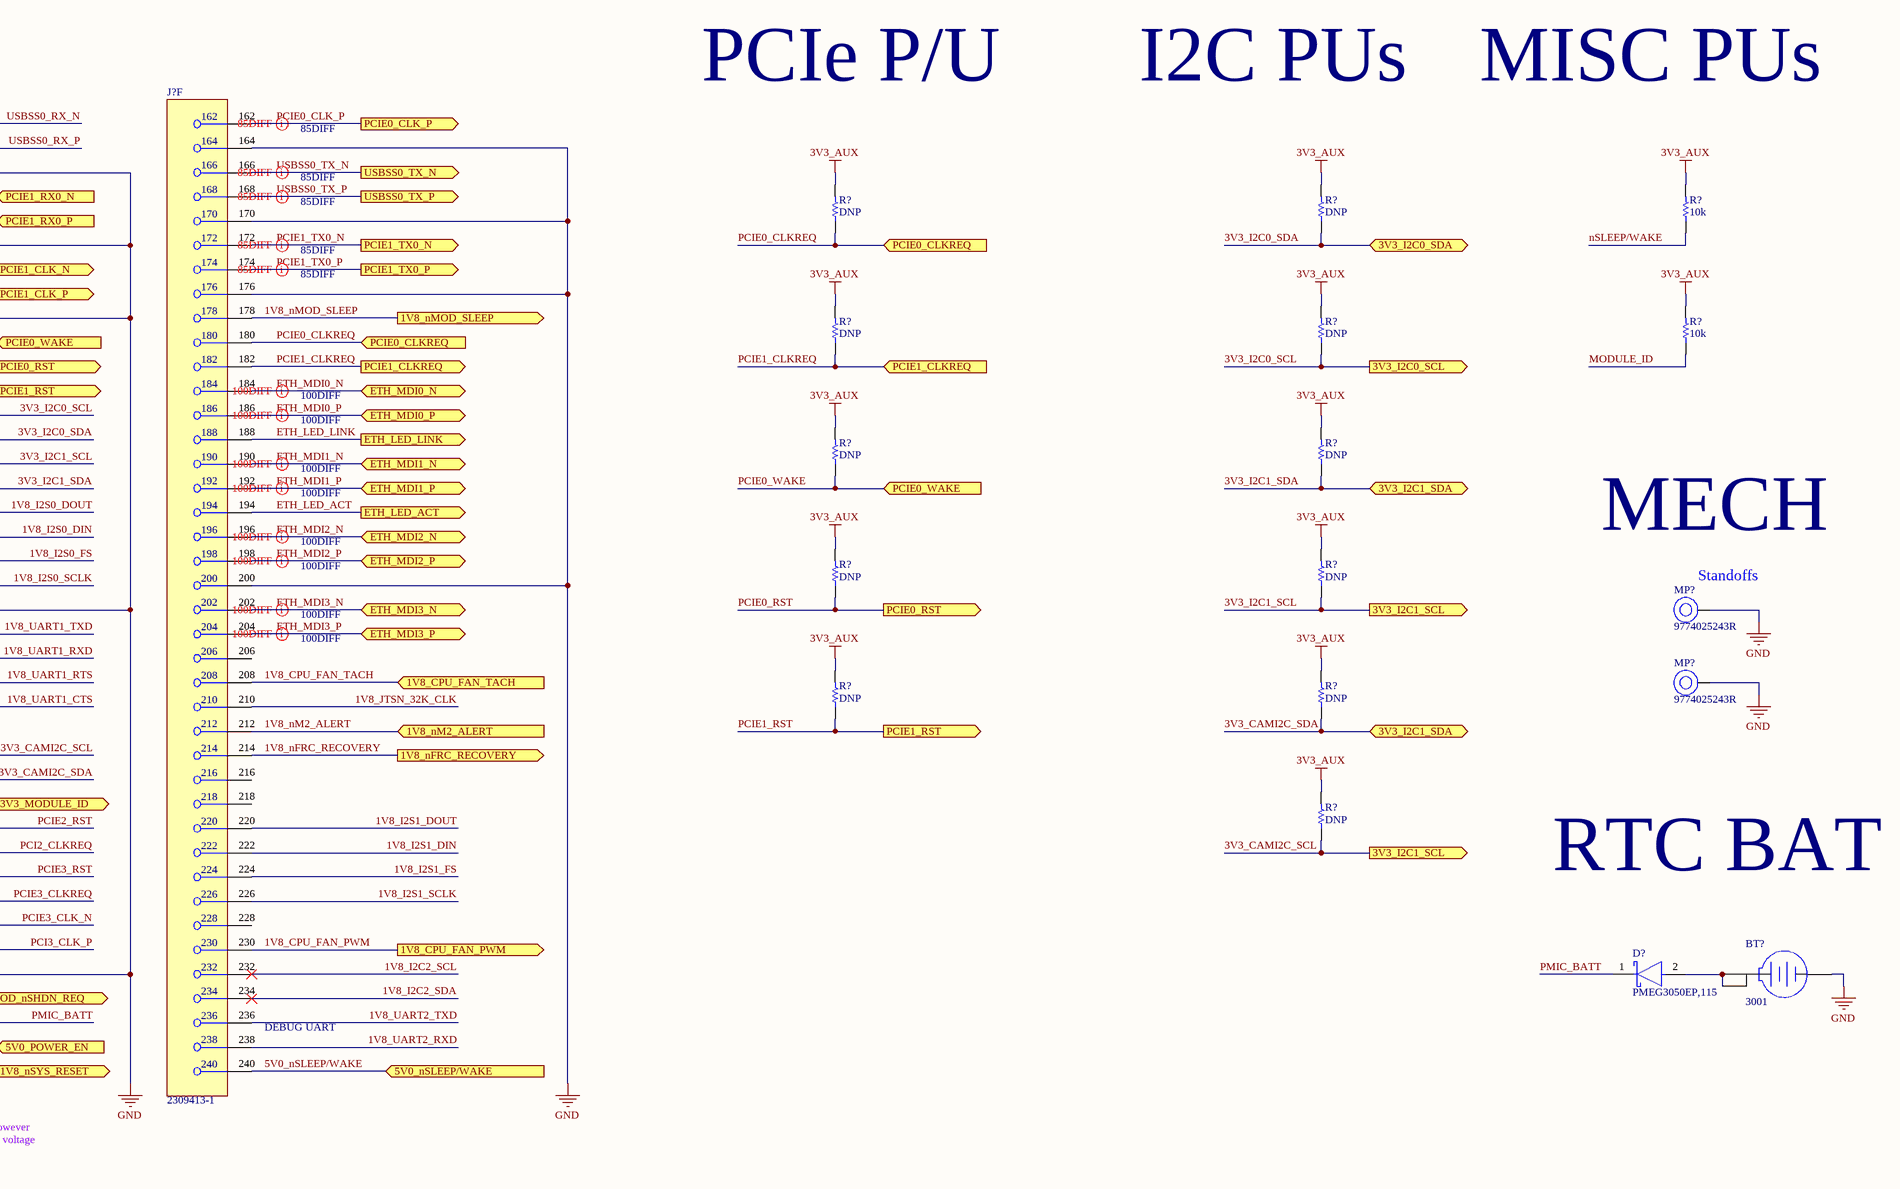
[diagram p7: JETSON_V2.SchDoc, top right]
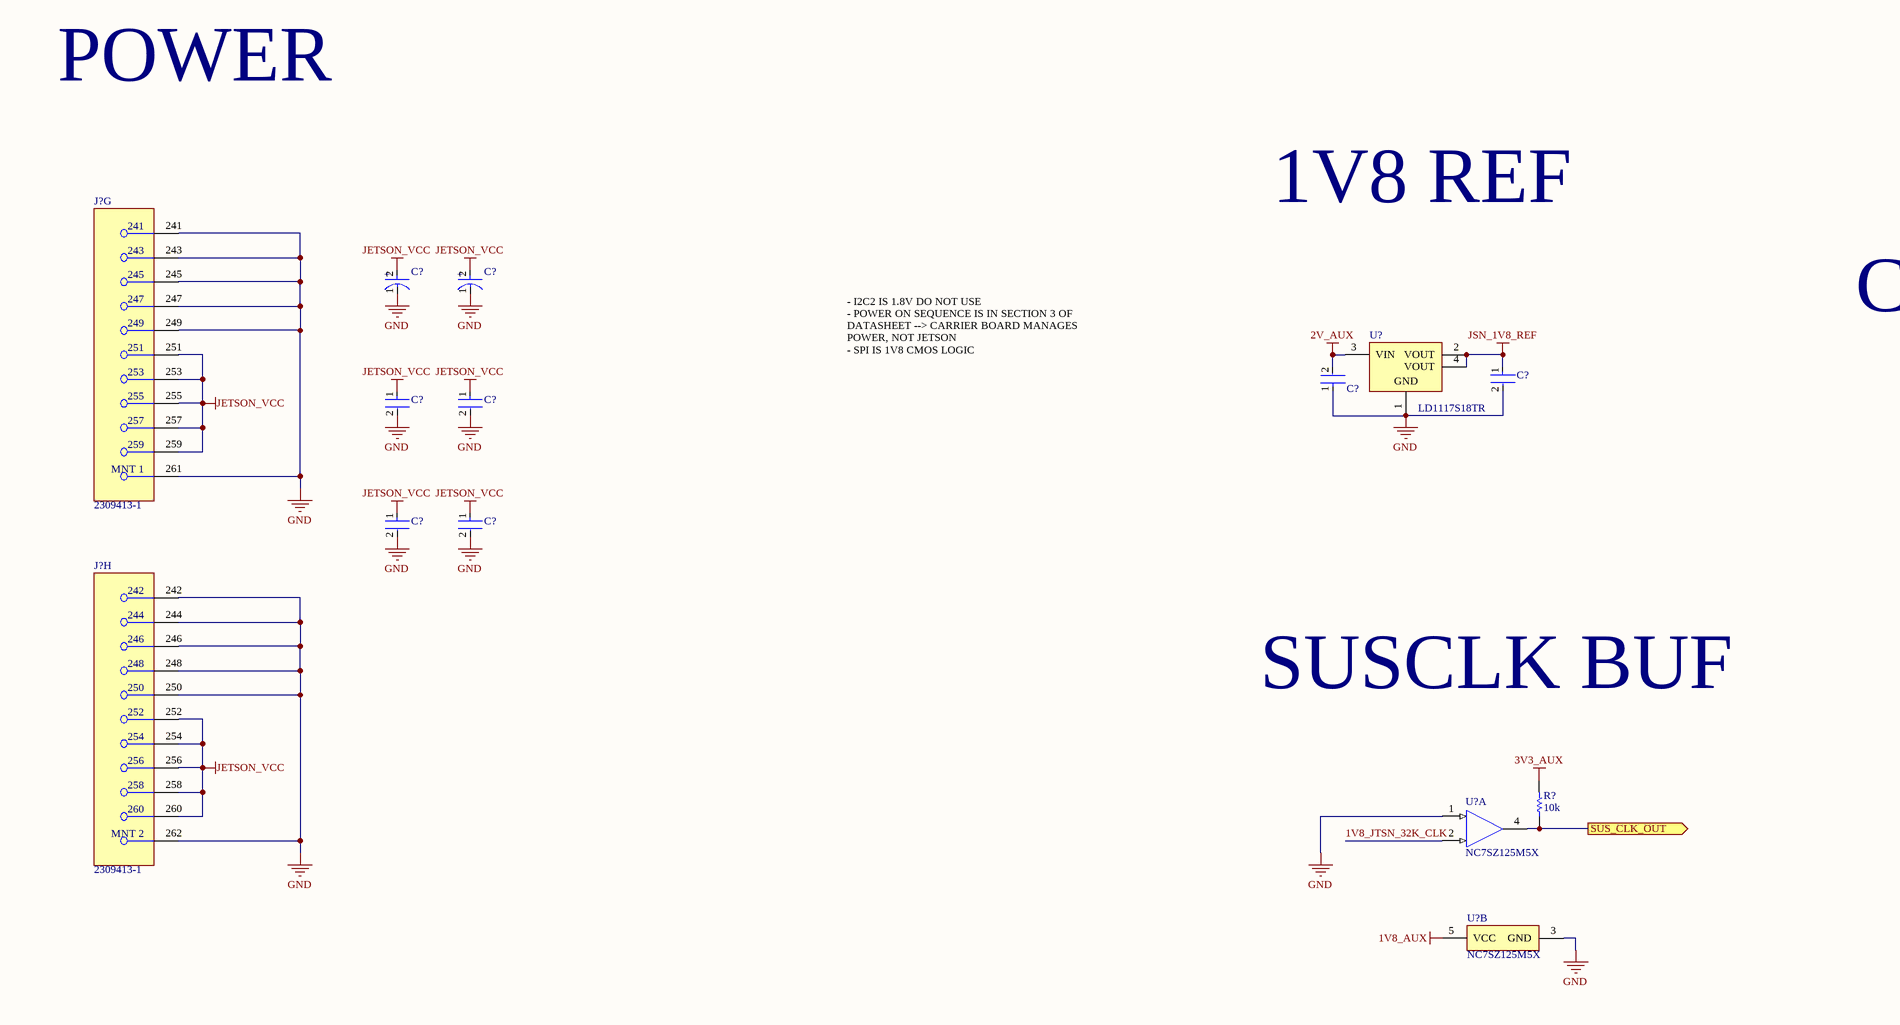
[diagram p8: JETSON_V2.SchDoc, bottom left]
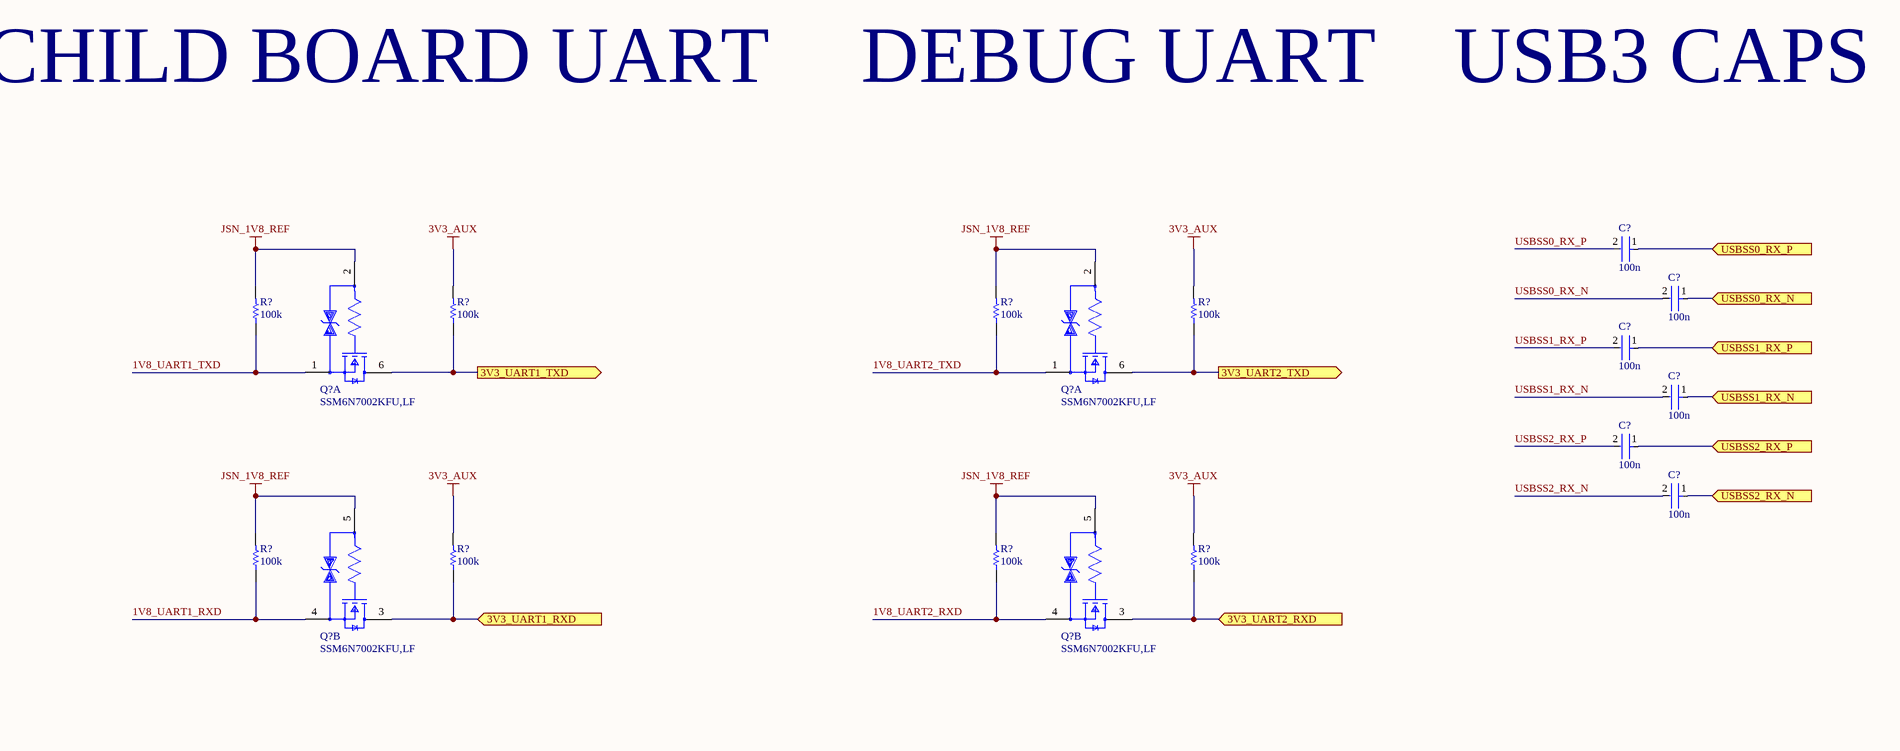
[diagram p9: JETSON_V2.SchDoc, bottom right]

### Parts
(Parts that share a designator on the sheet are numbered #1, #2 ... from top to bottom, then left to right.)
BT?  3001  [KSTN-3001_V]
C?#23  T491X107K025AT  [FP-T491X107K025AT-MFG]  (value not drawn)
C?#24  T491X107K025AT  [FP-T491X107K025AT-MFG]  (value not drawn)
C?#25  GRM188R60J106ME47D  [FP-GRM188-0_1-e0_2_0_55-IPC_A]  (value not drawn)
C?#26  12103D106KAT2A  [FP-1210-L_3_3_0_4-W_2_5_0-MFG]  (value not drawn)
C?#27  12103D106KAT2A  [FP-1210-L_3_3_0_4-W_2_5_0-MFG]  (value not drawn)
C?#28  C1005X7R1H104K050BB  [FP-C1005-050-0_05-IPC_C]  (value not drawn)
C?#29  100n  [FP-0402-L_1_0_0_05-W_0_5-IPC_A]
C?#30  12103D106KAT2A  [FP-1210-L_3_3_0_4-W_2_5_0-MFG]  (value not drawn)
C?#31  12103D106KAT2A  [FP-1210-L_3_3_0_4-W_2_5_0-MFG]  (value not drawn)
C?#32  100n  [FP-0402-L_1_0_0_05-W_0_5-IPC_A]
C?#33  100n  [FP-0402-L_1_0_0_05-W_0_5-IPC_A]
C?#34  100n  [FP-0402-L_1_0_0_05-W_0_5-IPC_A]
C?#35  100n  [FP-0402-L_1_0_0_05-W_0_5-IPC_A]
C?#36  100n  [FP-0402-L_1_0_0_05-W_0_5-IPC_A]
D?#1  PMEG3050EP,115  [FP-SOD128-MFG]
J?#4  2309413-1  [FP-2309413-1-MFG]  (part A of 8)
J?#5  2309413-1  [FP-2309413-1-MFG]  (part B of 8)
J?#6  2309413-1  [FP-2309413-1-MFG]  (part C of 8)
J?#7  2309413-1  [FP-2309413-1-MFG]  (part D of 8)
J?#8  2309413-1  [FP-2309413-1-MFG]  (part E of 8)
J?#9  2309413-1  [FP-2309413-1-MFG]  (part F of 8)
J?#10  2309413-1  [FP-2309413-1-MFG]  (part G of 8)
J?#11  2309413-1  [FP-2309413-1-MFG]  (part H of 8)
MP?#1  9774025243R  [9774025243]
MP?#2  9774025243R  [9774025243]
Q?#2  SSM6N7002KFU,LF  [FP-SSOP6-P-0_65A-MFG]  (part A of 2)
Q?#3  SSM6N7002KFU,LF  [FP-SSOP6-P-0_65A-MFG]  (part A of 2)
Q?#4  SSM6N7002KFU,LF  [FP-SSOP6-P-0_65A-MFG]  (part B of 2)
Q?#5  SSM6N7002KFU,LF  [FP-SSOP6-P-0_65A-MFG]  (part B of 2)
R?#5  DNP  [R0603B]
R?#6  DNP  [R0603B]
R?#7  10k  [R0603B]
R?#8  DNP  [R0603B]
R?#9  DNP  [R0603B]
R?#10  10k  [R0603B]
R?#11  DNP  [R0603B]
R?#12  DNP  [R0603B]
R?#13  DNP  [R0603B]
R?#14  DNP  [R0603B]
R?#15  DNP  [R0603B]
R?#16  DNP  [R0603B]
R?#17  DNP  [R0603B]
R?#18  100k  [R0603B]
R?#19  100k  [R0603B]
R?#20  100k  [R0603B]
R?#21  100k  [R0603B]
R?#22  100k  [R0603B]
R?#23  100k  [R0603B]
R?#24  100k  [R0603B]
R?#25  100k  [R0603B]
R?#26  10k  [R0603B]
U?#1  LD1117S18TR  [SOT-223_M]
U?#2  NC7SZ125M5X  [FAIR-SOT23-5_V]  (part A of 2)
U?#3  NC7SZ125M5X  [FAIR-SOT23-5_V]  (part B of 2)

### Ports
1V8_CPU_FAN_PWM (out), 1V8_CPU_FAN_TACH (in), 1V8_nFRC_RECOVERY (out), 1V8_nM2_ALERT (in), 1V8_nMOD_SLEEP (out), 1V8_nSYS_RESET (out), 1V8_UART0_CTS (out), 1V8_UART0_RTS (in), 1V8_UART0_RXD (in), 1V8_UART0_TXD (out), 3V3_CAN_RX (in), 3V3_CAN_TX (out), 3V3_I2C0_SCL (out), 3V3_I2C0_SDA (bidir), 3V3_I2C1_SCL (out), 3V3_I2C1_SDA (bidir), 3V3_MODULE_ID (out), 3V3_UART1_RXD (in), 3V3_UART1_TXD (out), 3V3_UART2_RXD (in), 3V3_UART2_TXD (out), 5V0_nSLEEP/WAKE (in), 5V0_POWER_EN (in), BT_M2_EN (GPIO03) (out), BT_M2_WAKE_AP (GPIO02) (in), CSI0_D0_N (bidir), CSI0_D0_P (bidir), CSI0_D1_N (bidir), CSI0_D1_P (bidir), CSI1_CLK_N (bidir), CSI1_CLK_P (bidir), CSI1_D0_N (bidir), CSI1_D0_P (bidir), CSI1_D1_N (bidir), CSI1_D1_P (bidir), CSI2_CLK_N (bidir), CSI2_CLK_P (bidir), CSI2_D0_N (bidir), CSI2_D0_P (bidir), CSI2_D1_N (bidir), CSI2_D1_P (bidir), CSI3_D0_N (bidir), CSI3_D0_P (bidir), CSI3_D1_N (bidir), CSI3_D1_P (bidir), DP1_AUX_N (bidir), DP1_AUX_P (bidir), DP1_CEC (bidir), DP1_HPD (in), DP1_TXD0_N (out), DP1_TXD0_P (out), DP1_TXD1_N (out), DP1_TXD1_P (out), DP1_TXD2_N (out), DP1_TXD2_P (out), DP1_TXD3_N (out), DP1_TXD3_P (out), ETH_LED_ACT (out), ETH_LED_LINK (out), ETH_MDI0_N (bidir), ETH_MDI0_P (bidir), ETH_MDI1_N (bidir), ETH_MDI1_P (bidir), ETH_MDI2_N (bidir), ETH_MDI2_P (bidir), ETH_MDI3_N (bidir), ETH_MDI3_P (bidir), nUSB0_VBUS_DET (in), OD_nSHDN_REQ (out), PCIE0_CLK_N (out), PCIE0_CLK_P (out), PCIE0_CLKREQ (in), PCIE0_RST (out), PCIE0_RX0_N (out), PCIE0_RX0_P (out), PCIE0_RX1_N (out), PCIE0_RX1_P (out), PCIE0_RX2_N (out), PCIE0_RX2_P (out), PCIE0_RX3_N (out), PCIE0_RX3_P (out), PCIE0_TX0_N (out), PCIE0_TX0_P (out), PCIE0_TX1_N (out), PCIE0_TX1_P (out), PCIE0_TX2_N (out), PCIE0_TX2_P (out), PCIE0_TX3_N (out), PCIE0_TX3_P (out), PCIE0_WAKE (in), PCIE1_CLK_N (out), PCIE1_CLK_P (out), PCIE1_CLKREQ (in), PCIE1_CLKREQ (out), PCIE1_RST (out), PCIE1_RX0_N (in), PCIE1_RX0_P (in), PCIE1_TX0_N (out), PCIE1_TX0_P (out), SUS_CLK_OUT (out), USBSS0_RX_N (in), USBSS0_RX_P (in), USBSS0_TX_N (out), USBSS0_TX_P (out), USBSS1_RX_N (in), USBSS1_RX_P (in), USBSS1_TX_N (out), USBSS1_TX_P (out), USBSS2_RX_N (in), USBSS2_RX_P (in), USBSS2_TX_N (out), USBSS2_TX_P (out), W_DISABLE1_CTRL (GPIO05) (out)

### Nets
1V8_AUX: U?#3.5(VCC)
2V_AUX: C?#28.2 U?#1.3(VIN)  [project net RAIL]
3V3_AUX: R?#5.2 R?#6.2 R?#7.2 R?#8.2 R?#9.2 R?#10.2 R?#11.2 R?#12.2 R?#13.2 R?#14.2 R?#15.2 R?#16.2 R?#17.2 R?#19.2 R?#21.2 R?#23.2 R?#25.2 R?#26.2  [project net RAIL]
GND: BT?.3(-) C?#23.1(C) C?#24.1(C) C?#25.2 C?#26.2 C?#27.2 C?#28.1 C?#30.2 C?#31.2 J?#4.1 J?#4.7 J?#4.13 J?#4.19 J?#4.25 J?#4.31 J?#4.37 J?#4.43 J?#4.49 J?#4.55 J?#4.61 J?#4.67 J?#4.73 J?#4.79 J?#5.2 J?#5.8 J?#5.14 J?#5.20 J?#5.26 J?#5.32 J?#5.38 J?#5.44 J?#5.50 J?#5.56 J?#5.62 J?#5.68 J?#5.74 J?#5.80 J?#6.85 J?#6.107 J?#6.113 J?#6.119 J?#6.125 J?#6.129 J?#6.135 J?#6.141 J?#6.147 J?#6.153 J?#6.159 J?#7.86 J?#7.102 J?#7.132 J?#7.138 J?#7.144 J?#7.146 J?#7.152 J?#7.158 J?#8.165 J?#8.171 J?#8.177 J?#8.201 J?#8.231 J?#9.164 J?#9.170 J?#9.176 J?#9.200 J?#10.241 J?#10.243 J?#10.245 J?#10.247 J?#10.249 J?#10.261(MNT_1) J?#11.242 J?#11.244 J?#11.246 J?#11.248 J?#11.250 J?#11.262(MNT_2) MP?#1.1 MP?#2.1 U?#1.1(GND) U?#2.1(~{OE}) U?#3.3(GND)
JETSON_VCC: C?#23.2(A) C?#24.2(A) C?#26.1 C?#27.1 C?#30.1 C?#31.1 J?#10.251 J?#10.253 J?#10.255 J?#10.257 J?#10.259 J?#11.252 J?#11.254 J?#11.256 J?#11.258 J?#11.260
JSN_1V8_REF: C?#25.1 Q?#2.2(Gate1) Q?#3.2(Gate1) Q?#4.5(Gate2) Q?#5.5(Gate2) R?#18.2 R?#20.2 R?#22.2 R?#24.2 U?#1.2(VOUT) U?#1.4(VOUT)
1V8_CAM0_MCLK: J?#7.116
1V8_CAM0_PWDN: J?#7.114
1V8_CAM1_MCLK: J?#7.122
1V8_CAM1_PWDN: J?#7.120
1V8_CPU_FAN_PWM: J?#9.230 ; port 1V8_CPU_FAN_PWM
1V8_CPU_FAN_TACH: J?#9.208 ; port 1V8_CPU_FAN_TACH
1V8_I2C2_SCL: J?#9.232
1V8_I2C2_SDA: J?#9.234
1V8_I2S0_DIN: J?#8.195
1V8_I2S0_DOUT: J?#8.193
1V8_I2S0_FS: J?#8.197
1V8_I2S0_SCLK: J?#8.199
1V8_I2S1_DIN: J?#9.222
1V8_I2S1_DOUT: J?#9.220
1V8_I2S1_FS: J?#9.224
1V8_I2S1_SCLK: J?#9.226
1V8_JTSN_32K_CLK: J?#9.210 U?#2.2(A)
1V8_nFRC_RECOVERY: J?#9.214 ; port 1V8_nFRC_RECOVERY
1V8_nM2_ALERT: J?#9.212 ; port 1V8_nM2_ALERT
1V8_nMOD_SLEEP: J?#9.178 ; port 1V8_nMOD_SLEEP
1V8_nSYS_RESET: J?#8.239 ; port 1V8_nSYS_RESET
1V8_SPI0_MISO: J?#6.93
1V8_SPI0_MOSI: J?#6.89
1V8_SPI0_nCS0: J?#6.95
1V8_SPI0_nCS1: J?#6.97
1V8_SPI0_SCLK: J?#6.91
1V8_SPI1_MISO: J?#7.108
1V8_SPI1_MOSI: J?#7.104
1V8_SPI1_nCS0: J?#7.110
1V8_SPI1_nCS1: J?#7.112
1V8_SPI1_SCLK: J?#7.106
1V8_UART0_CTS: J?#6.105 ; port 1V8_UART0_CTS
1V8_UART0_RTS: J?#6.103 ; port 1V8_UART0_RTS
1V8_UART0_RXD: J?#6.101 ; port 1V8_UART0_RXD
1V8_UART0_TXD: J?#6.99 ; port 1V8_UART0_TXD
1V8_UART1_CTS: J?#8.209
1V8_UART1_RTS: J?#8.207
1V8_UART1_RXD: J?#8.205 Q?#4.4(Source2) R?#22.1
1V8_UART1_TXD: J?#8.203 Q?#2.1(Source1) R?#18.1
1V8_UART2_RXD: J?#9.238 Q?#5.4(Source2) R?#24.1
1V8_UART2_TXD: J?#9.236 Q?#3.1(Source1) R?#20.1
3V3_CAMI2C_SCL: J?#8.189 J?#8.213 R?#14.1 R?#17.1 ; port 3V3_I2C1_SCL  [also labelled 3V3_I2C1_SCL]
3V3_CAMI2C_SDA: J?#8.191 J?#8.215 R?#12.1 R?#16.1 ; port 3V3_I2C1_SDA  [also labelled 3V3_I2C1_SDA]
3V3_CAN_RX: J?#6.143 ; port 3V3_CAN_RX
3V3_CAN_TX: J?#6.145 ; port 3V3_CAN_TX
3V3_I2C0_SCL: J?#8.185 R?#9.1 ; port 3V3_I2C0_SCL
3V3_I2C0_SDA: J?#8.187 R?#6.1 ; port 3V3_I2C0_SDA
3V3_MODULE_ID: J?#8.217 ; port 3V3_MODULE_ID
5V0_nSLEEP/WAKE: J?#9.240 ; port 5V0_nSLEEP/WAKE
5V0_POWER_EN: J?#8.237 ; port 5V0_POWER_EN
BT_M2_EN (GPIO03): J?#7.126 ; port BT_M2_EN (GPIO03)
BT_M2_WAKE_AP (GPIO02): J?#7.124 ; port BT_M2_WAKE_AP (GPIO02)
CSI0_CLK_N: J?#5.10
CSI0_CLK_P: J?#5.12
CSI0_D0_N: J?#5.4 ; port CSI0_D0_N
CSI0_D0_P: J?#5.6 ; port CSI0_D0_P
CSI0_D1_N: J?#5.16 ; port CSI0_D1_N
CSI0_D1_P: J?#5.18 ; port CSI0_D1_P
CSI1_CLK_N: J?#4.9 ; port CSI1_CLK_N
CSI1_CLK_P: J?#4.11 ; port CSI1_CLK_P
CSI1_D0_N: J?#4.3 ; port CSI1_D0_N
CSI1_D0_P: J?#4.5 ; port CSI1_D0_P
CSI1_D1_N: J?#4.15 ; port CSI1_D1_N
CSI1_D1_P: J?#4.17 ; port CSI1_D1_P
CSI2_CLK_N: J?#5.28 ; port CSI2_CLK_N
CSI2_CLK_P: J?#5.30 ; port CSI2_CLK_P
CSI2_D0_N: J?#5.22 ; port CSI2_D0_N
CSI2_D0_P: J?#5.24 ; port CSI2_D0_P
CSI2_D1_N: J?#5.34 ; port CSI2_D1_N
CSI2_D1_P: J?#5.36 ; port CSI2_D1_P
CSI3_CLK_N: J?#4.27
CSI3_CLK_P: J?#4.29
CSI3_D0_N: J?#4.21 ; port CSI3_D0_N
CSI3_D0_P: J?#4.23 ; port CSI3_D0_P
CSI3_D1_N: J?#4.33 ; port CSI3_D1_N
CSI3_D1_P: J?#4.35 ; port CSI3_D1_P
DP0_AUX_N: J?#7.90
DP0_AUX_P: J?#7.92
DP0_HPD: J?#7.88
DP1_AUX_N: J?#7.98 ; port DP1_AUX_N
DP1_AUX_P: J?#7.100 ; port DP1_AUX_P
DP1_CEC: J?#7.94 ; port DP1_CEC
DP1_HPD: J?#7.96 ; port DP1_HPD
DP1_TXD0_N: J?#4.63 ; port DP1_TXD0_N
DP1_TXD0_P: J?#4.65 ; port DP1_TXD0_P
DP1_TXD1_N: J?#4.69 ; port DP1_TXD1_N
DP1_TXD1_P: J?#4.71 ; port DP1_TXD1_P
DP1_TXD2_N: J?#4.75 ; port DP1_TXD2_N
DP1_TXD2_P: J?#4.77 ; port DP1_TXD2_P
DP1_TXD3_N: J?#6.81 ; port DP1_TXD3_N
DP1_TXD3_P: J?#6.83 ; port DP1_TXD3_P
DSI0_CLK_N: J?#5.76
DSI0_CLK_P: J?#5.78
DSI0_D0_N: J?#5.70
DSI0_D0_P: J?#5.72
DSI0_D1_N: J?#7.82
DSI0_D1_P: J?#7.84
ETH_LED_ACT: J?#9.194 ; port ETH_LED_ACT
ETH_LED_LINK: J?#9.188 ; port ETH_LED_LINK
ETH_MDI0_N: J?#9.184 ; port ETH_MDI0_N
ETH_MDI0_P: J?#9.186 ; port ETH_MDI0_P
ETH_MDI1_N: J?#9.190 ; port ETH_MDI1_N
ETH_MDI1_P: J?#9.192 ; port ETH_MDI1_P
ETH_MDI2_N: J?#9.196 ; port ETH_MDI2_N
ETH_MDI2_P: J?#9.198 ; port ETH_MDI2_P
ETH_MDI3_N: J?#9.202 ; port ETH_MDI3_N
ETH_MDI3_P: J?#9.204 ; port ETH_MDI3_P
MODULE_ID: R?#10.1
nSLEEP/WAKE: R?#7.1
nUSB0_VBUS_DET: J?#6.87 ; port nUSB0_VBUS_DET
OD_nSHDN_REQ: J?#8.233 ; port OD_nSHDN_REQ
PCI2_CLKREQ: J?#8.221
PCI3_CLK_P: J?#8.229
PCIE0_CLK_N: J?#7.160 ; port PCIE0_CLK_N
PCIE0_CLK_P: J?#9.162 ; port PCIE0_CLK_P
PCIE0_CLKREQ: J?#9.180 R?#5.1 ; port PCIE0_CLKREQ
PCIE0_RST: J?#8.181 R?#13.1 ; port PCIE0_RST
PCIE0_RX0_N: J?#6.131 ; port PCIE0_RX0_N
PCIE0_RX0_P: J?#6.133 ; port PCIE0_RX0_P
PCIE0_RX1_N: J?#6.137 ; port PCIE0_RX1_N
PCIE0_RX1_P: J?#6.139 ; port PCIE0_RX1_P
PCIE0_RX2_N: J?#6.149 ; port PCIE0_RX2_N
PCIE0_RX2_P: J?#6.151 ; port PCIE0_RX2_P
PCIE0_RX3_N: J?#6.155 ; port PCIE0_RX3_N
PCIE0_RX3_P: J?#6.157 ; port PCIE0_RX3_P
PCIE0_TX0_N: J?#7.134 ; port PCIE0_TX0_N
PCIE0_TX0_P: J?#7.136 ; port PCIE0_TX0_P
PCIE0_TX1_N: J?#7.140 ; port PCIE0_TX1_N
PCIE0_TX1_P: J?#7.142 ; port PCIE0_TX1_P
PCIE0_TX2_N: J?#7.148 ; port PCIE0_TX2_N
PCIE0_TX2_P: J?#7.150 ; port PCIE0_TX2_P
PCIE0_TX3_N: J?#7.154 ; port PCIE0_TX3_N
PCIE0_TX3_P: J?#7.156 ; port PCIE0_TX3_P
PCIE0_WAKE: J?#8.179 R?#11.1 ; port PCIE0_WAKE
PCIE1_CLK_N: J?#8.173 ; port PCIE1_CLK_N
PCIE1_CLK_P: J?#8.175 ; port PCIE1_CLK_P
PCIE1_CLKREQ: J?#9.182 R?#8.1 ; port PCIE1_CLKREQ
PCIE1_RST: J?#8.183 R?#15.1 ; port PCIE1_RST
PCIE1_RX0_N: J?#8.167 ; port PCIE1_RX0_N
PCIE1_RX0_P: J?#8.169 ; port PCIE1_RX0_P
PCIE1_TX0_N: J?#9.172 ; port PCIE1_TX0_N
PCIE1_TX0_P: J?#9.174 ; port PCIE1_TX0_P
PCIE2_CLK_N: J?#5.52
PCIE2_CLK_P: J?#5.54
PCIE2_RST: J?#8.219
PCIE2_RX0_N: J?#5.40
PCIE2_RX0_P: J?#5.42
PCIE2_RX1_N: J?#5.58
PCIE2_RX1_P: J?#5.60
PCIE2_TX0_N: J?#5.46
PCIE2_TX0_P: J?#5.48
PCIE2_TX1_N: J?#5.64
PCIE2_TX1_P: J?#5.66
PCIE3_CLK_N: J?#8.227
PCIE3_CLKREQ: J?#8.225
PCIE3_RST: J?#8.223
PMIC_BATT: D?#1.1(C) J?#8.235
USB2_0_N: J?#6.109
USB2_0_P: J?#6.111
USB2_1_N: J?#6.115
USB2_1_P: J?#6.117
USB2_2_N: J?#6.121
USB2_2_P: J?#6.123
USBSS0_RX_N: C?#32.2 J?#8.161
USBSS0_RX_P: C?#29.2 J?#8.163
USBSS0_TX_N: J?#9.166 ; port USBSS0_TX_N
USBSS0_TX_P: J?#9.168 ; port USBSS0_TX_P
USBSS1_RX_N: C?#34.2 J?#4.39
USBSS1_RX_P: C?#33.2 J?#4.41
USBSS1_TX_N: J?#4.45 ; port USBSS1_TX_N
USBSS1_TX_P: J?#4.47 ; port USBSS1_TX_P
USBSS2_RX_N: C?#36.2 J?#4.51
USBSS2_RX_P: C?#35.2 J?#4.53
USBSS2_TX_N: J?#4.57 ; port USBSS2_TX_N
USBSS2_TX_P: J?#4.59 ; port USBSS2_TX_P
W_DISABLE1_CTRL (GPIO05): J?#7.128 ; port W_DISABLE1_CTRL (GPIO05)
NetBT?_1: BT?.1(+) BT?.2(+) D?#1.2(A)
NetC?#29_1: C?#29.1 ; port USBSS0_RX_P
NetC?#32_1: C?#32.1 ; port USBSS0_RX_N
NetC?#33_1: C?#33.1 ; port USBSS1_RX_P
NetC?#34_1: C?#34.1 ; port USBSS1_RX_N
NetC?#35_1: C?#35.1 ; port USBSS2_RX_P
NetC?#36_1: C?#36.1 ; port USBSS2_RX_N
NetQ?#2_6: Q?#2.6(Drain1) R?#19.1 ; port 3V3_UART1_TXD
NetQ?#3_6: Q?#3.6(Drain1) R?#21.1 ; port 3V3_UART2_TXD
NetQ?#4_3: Q?#4.3(Drain2) R?#23.1 ; port 3V3_UART1_RXD
NetQ?#5_3: Q?#5.3(Drain2) R?#25.1 ; port 3V3_UART2_RXD
NetR?#26_1: R?#26.1 U?#2.4(Y) ; port SUS_CLK_OUT

Not connected (* = marked no-connect by the designer): J?#6 127; J?#7 118 130; J?#8 211; J?#9 206 216 218 228

### Layout directives
differential pair; differential pair class 90DIFF: USB2_0_N, USB2_0_P, USB2_1_N, USB2_1_P, USB2_2_N, USB2_2_P
differential pair; differential pair class 100DIFF: CSI0_CLK_N, CSI0_CLK_P, CSI0_D0_N, CSI0_D0_P, CSI0_D1_N, CSI0_D1_P, CSI1_CLK_N, CSI1_CLK_P, CSI1_D0_N, CSI1_D0_P, CSI1_D1_N, CSI1_D1_P, CSI2_CLK_N, CSI2_CLK_P, CSI2_D0_N, CSI2_D0_P, CSI2_D1_N, CSI2_D1_P, CSI3_CLK_N, CSI3_CLK_P, CSI3_D0_N, CSI3_D0_P, CSI3_D1_N, CSI3_D1_P, DP1_TXD0_N, DP1_TXD0_P, DP1_TXD1_N, DP1_TXD1_P, DP1_TXD2_N, DP1_TXD2_P, DP1_TXD3_N, DP1_TXD3_P, DSI0_CLK_N, DSI0_CLK_P, DSI0_D0_N, DSI0_D0_P, DSI0_D1_N, DSI0_D1_P, ETH_MDI0_N, ETH_MDI0_P, ETH_MDI1_N, ETH_MDI1_P, ETH_MDI2_N, ETH_MDI2_P, ETH_MDI3_N, ETH_MDI3_P
differential pair; differential pair class 85DIFF: PCI3_CLK_P, PCIE0_CLK_N, PCIE0_CLK_P, PCIE0_RX0_N, PCIE0_RX0_P, PCIE0_RX1_N, PCIE0_RX1_P, PCIE0_RX2_N, PCIE0_RX2_P, PCIE0_RX3_N, PCIE0_RX3_P, PCIE0_TX0_N, PCIE0_TX0_P, PCIE0_TX1_N, PCIE0_TX1_P, PCIE0_TX2_N, PCIE0_TX2_P, PCIE0_TX3_N, PCIE0_TX3_P, PCIE1_CLK_N, PCIE1_CLK_P, PCIE1_RX0_N, PCIE1_RX0_P, PCIE1_TX0_N, PCIE1_TX0_P, PCIE2_CLK_N, PCIE2_CLK_P, PCIE2_RX0_N, PCIE2_RX0_P, PCIE2_RX1_N, PCIE2_RX1_P, PCIE2_TX0_N, PCIE2_TX0_P, PCIE2_TX1_N, PCIE2_TX1_P, PCIE3_CLK_N, USBSS0_RX_N, USBSS0_RX_P, USBSS0_TX_N, USBSS0_TX_P, USBSS1_RX_N, USBSS1_RX_P, USBSS1_TX_N, USBSS1_TX_P, USBSS2_RX_N, USBSS2_RX_P, USBSS2_TX_N, USBSS2_TX_P

### Notes on the sheet
- FIGURE 10-1 OF ORIN SERIES DESIGN GUIDE, POLARITY OF SOME CSI LANES IS SWAPPED ON SoC
- SODIMM CONNECTOR
- PCIe P/U
- I2C PUs
- MISC PUs
- DEBUG USB
- TYPE A USB
- MECH
- M.2 USB
- (near MP?#1) Standoffs
- RTC BAT
- (near J?#9) DEBUG UART
- OD means open/drain, however Jetson specifies that max voltage at this pin cannot exceed JETSON_VCC
- POWER
- 1V8 REF
- CHILD BOARD UART
- DEBUG UART
- USB3 CAPS
- - I2C2 IS 1.8V DO NOT USE
  - POWER ON SEQUENCE IS IN SECTION 3 OF DATASHEET --> CARRIER BOARD MANAGES POWER, NOT JETSON
  - SPI IS 1V8 CMOS LOGIC
- SUSCLK BUF
- (in symbol CMP-2000-07204-2) +

### Library data of the parts
BT? = CMP-2000-05463-1: Holder Battery Coin, 12 mm, 2-Pin THD, RoHS; Manufacturer: Keystone; Package Reference: 3001; Package Description: 2-Pin Through Hole Device, Body 13.21 x 12.07 mm; Datasheet Version: Rev. H, 09/2006; Datasheet URL: https://datasheet.ciiva.com/3/3001-3954.pdf; Mounting Technology: ThroughHole; Manufacturer URL: http://www.keyelco.com/
C?#23 C?#24 = CMP-2000-07204-2: CAP TANT 100UF 10% 25V 2917; Leakage Current: 25uA; Ripple Current: 742mA; Polarity: Polar; Dissipation Factor: 8%; Life (Hours): 2000Hour; Dielectric Material: Tantalum; ESR (Equivalent Series Resistance): 300mR; Length: 7.3mm; RoHS Compliant: No; Failure Rate: 0.001%; REACH SVHC: No SVHC; Tolerance: 10%; Mount: Surface Mount; Height - Seated (Max): 0.169inch; Features: General Purpose; Height: 4mm; Package Quantity: 1; Case Code (Metric): 7343; Max Operating Temperature: 125°C; Number of Pins: 2; Radiation Hardening: No; Lead Free: Lead Free; Capacitance: 100uF; Termination: SMD/SMT; Voltage Rating: 25V; Series: T491; Depth: 4.3mm; Construction: Flat; Case/Package: 2917; Min Operating Temperature: -55°C; Voltage Rating (DC): 25V; Width: 4.3mm; Packaging: Tape and Reel; Case Code (Imperial): 2917; Voltage: 25V
C?#25 = CMP-2006-02792-2: Chip Multilayer Ceramic Capacitors for General Purpose, 0603, 10uF, X5R, 15%, 20%, 6.3V; Packaging: Tape and Reel; Voltage Rating (DC): 6.3V; Width: 0.031inch; Termination: SMD/SMT; Dielectric: X5R; Package Quantity: 4000; Voltage Rating: 6.3V; Capacitance: 10uF; Case/Package: 0603; Min Operating Temperature: -55°C; Voltage: 6.3V; Length: 1.6mm; Thickness: 0.035inch; Lead Free: Lead Free; Depth: 0.8mm; Case Code (Imperial): 0603; Max Operating Temperature: 85°C; Material: Ceramic; Height: 0.8mm; Tolerance: 20%; Mount: Surface Mount; REACH SVHC: No SVHC; Radiation Hardening: No; Case Code (Metric): 1608
C?#26 C?#27 C?#30 C?#31 = CMP-2000-05477-2: General Purpose Ceramic Capacitor, 1210, 10uF, 10%, X5R, 15%, 25V; Lead Free: Lead Free; Max Operating Temperature: 85°C; REACH SVHC: No SVHC; Depth: 2.5mm; Packaging: Tape and Reel; Min Operating Temperature: -55°C; Height: 2.29mm; Construction: Flat; Case Code (Imperial): 1210; Radiation Hardening: No; Voltage: 25V; Case/Package: 1210; Series: -; Dielectric: X5R; Length: 3.2mm; Thickness: 0.11inch; Package Quantity: 1; Termination: SMD/SMT; Case Code (Metric): 3225; Voltage Rating (DC): 25V; Voltage Rating: 25V; Contact Plating: Tin; RoHS Compliant: Yes; Mount: Surface Mount; Width: 0.098inch; Capacitance: 10uF; Tolerance: 10%
C?#28 = CMP-2000-05393-2: Multilayer Ceramic Capacitors 100nF ±10% 50V X7R SMD 0402; Voltage: 50V; Dielectric Material: Ceramic; Min Operating Temperature: -55°C; Depth: 0.5mm; Radiation Hardening: No; RoHS Compliant: Yes; Voltage Rating (DC): 50V; Lead Free: Lead Free; Resistor Type: Ceramic; Height: 0.5mm; Dielectric: X7R; Thickness: 0.022inch; Case/Package: 0402; Case Code (Metric): 1005; Termination: SMD/SMT; Capacitance: 100nF; Packaging: Tape and Reel; Max Operating Temperature: 125°C; Mount: Surface Mount; Package Quantity: 1; Width: 0.02inch; Weight: 2.3E-05oz; Voltage Rating: 50V; Tolerance: 10%; Construction: Flat; Case Code (Imperial): 0402; Length: 1mm; REACH SVHC: No SVHC; Series: C
C?#29 C?#32-C?#36 = CMP-001-00058-1: as C?#1 on sheet MAIN_BOARD; Min Operating Temperature: -55°C; Mounting Technology: Surface Mount; Pins: 2; Case/Package: 0402; RoHS Compliant: Yes; Max Operating Temperature: 85°C
D?#1 = CMP-14398-000051-1: DIODE SCHOTTKY 30V 5A SOD128; RoHS Compliant: Yes
J?#4-J?#11 = CMP-03356-000001-1: DDR4 SODIMM 260P 9.2H STD; Manufacturer: TE Connectivity; Voltage Rating: 25V; Current Rating: 0.5A; Is Female: yes; Pitch: 0.5mm; Memory Type: SDRAM,DDR; Conn Orientation: Horizontal; Number Of Contacts: 260; Temperature: -55°C to +85°C; Octopart: https://octopart.com/2309413-1-te+connectivity-84799194; Device Class L3: unset; Contact Material: Gold,Nickel; ComponentLink2URL: https://www.te.com/commerce/DocumentDelivery/DDEController?Action=showdoc&DocId=Specification+Or+Standard%7F108-115122%7FA1%7Fpdf%7FEnglish%7FENG_SS_108-115122_A1.pdf%7F2309413-1; Manufacturer Part Number: 2309413-1; ComponentLink2Description: Datasheet; Digikey Description: DDR4 SODIMM 260P 9.2H STD; Height: 18.8mm; Footprint Url: https://www.te.com/commerce/DocumentDelivery/DDEController?Action=showdoc&DocId=Customer+Drawing%7F2309413%7F4%7Fpdf%7FEnglish%7FENG_CD_2309413_4.pdf%7F2309413-1; Temperature Range Low: -55°C; Device Class L2: Memory Connectors; Temperature Range High: +85°C; RoHS: TRUE; Automotive: No; Device Class L1: Connectors; Mouser Description: Conn DDR4 DIMM Socket SKT 260 POS 0.5mm Solder RA SMD T/R; Category: Conn; Package: 0; Lead Free: Yes
MP?#1 MP?#2 = CMP-03913-59774857-1: 9774025243R Spacer Material: Steel, Tin-Plated Mounting: SMT Series: WA-SMST Thread D: M2; Outside Diameter: 4.3434mm; Threaded/Unthreaded: Threaded; Plating: Tin; REACH SVHC: Unknown; NexarPartId: 59774857; RoHS: Compliant; Material: Steel; Packaging: Tape and Reel; Max Operating Temperature: 150°C; Min Operating Temperature: -55°C; Length: 2.5mm; Height: 2.5mm
Q?#2-Q?#5 = CMP-35916-000009-1: MOSFET 2N-CH 60V 0.3A; Input Capacitance: 40pF; Continuous Drain Current (ID): 300mA; Max Power Dissipation: 285mW; FET Type: 2 N-Channel; Rds On Max: 1.5R; Mount: Surface Mount; Drain to Source Voltage (Vdss): 60V; Packaging: Tape and Reel
R?#5-R?#26 = CMP-009-00002-14: Resistor
U?#1 = CMP-0244-00308-1: Fixed Low Drop Positive Voltage Regulator, 1.8V, 4-Pin SOT-223, Tape and Reel; ComponentLink1URL: http://www.st.com; PackageReference: SOT-223; PackageDescription: 4-Pin SOT-223 Package, 6.5 x 3.5 mm Body, 2.3 mm Pitch, 7 mm Lead Span; ComponentLink2URL: http://www.st.com/internet/com/TECHNICAL_RESOURCES/TECHNICAL_LITERATURE/DATASHEET/CD00000544.pdf; ComponentLink2Description: Datasheet; ComponentLink1Description: Manufacturer URL; DatasheetVersion: 1/11/2011; PackageVersion: 2010
U?#2 U?#3 = CMP-2000-06816-1: TinyLogic UHS Buffer with Three-State Output, 1.65 to 5.5 V, -40 to 85 degC, 5-Pin SOT23, RoHS, Tape and Reel; Manufacturer: Fairchild Semiconductor; Input Signal Type: Single-Ended; Maximum Operating Supply Voltage: 5.5V; Number of Outputs per Chip: 1; Maximum Propagation Delay Time @ Maximum CL: 5.7@3.3V; Minimum Operating Supply Voltage: 1.65V; Maximum Quiescent Current: 2uA; Propagation Delay Test Condition: 50pF; Lead Finish: MatteTin; Number of Output Enables per Chip: 1Low; Maximum Low Level Output Current: 32mA; Output Type: 3-State; Package Version: 08/2015; Max Processing Temp: 260; Maximum High Level Output Current: -32mA; Tolerant I/Os: 5V; Bus Hold: No; Fabrication Technology: CMOS; Polarity: Non-Inverting; Typical Operating Supply Voltage: 1.8; Logic Function: Buffer/LineDriver; Manufacturer URL: https://www.fairchildsemi.com/; Mounting: SurfaceMount; Number of Channels per Chip: 1; Package Description: 5-Pin Small Outline Transistor, Body 2.9 x 1.6 mm, Pitch 0.95 mm; Package Reference: SOT23-5; Number of Elements per Chip: 1; Package URL: https://www.fairchildsemi.com/package-drawings/MA/MA05B.pdf; Datasheet URL: https://www.fairchildsemi.com/datasheets/NC/NC7SZ125.pdf; Datasheet Version: Rev. 1.0.5, 01/2014; Mounting Technology: SurfaceMount; Operating Temperature: -40to85C; Number of Inputs per Chip: 1

## Sheet NVME.SchDoc
size C; SheetNumber: 4; SheetTotal: 14
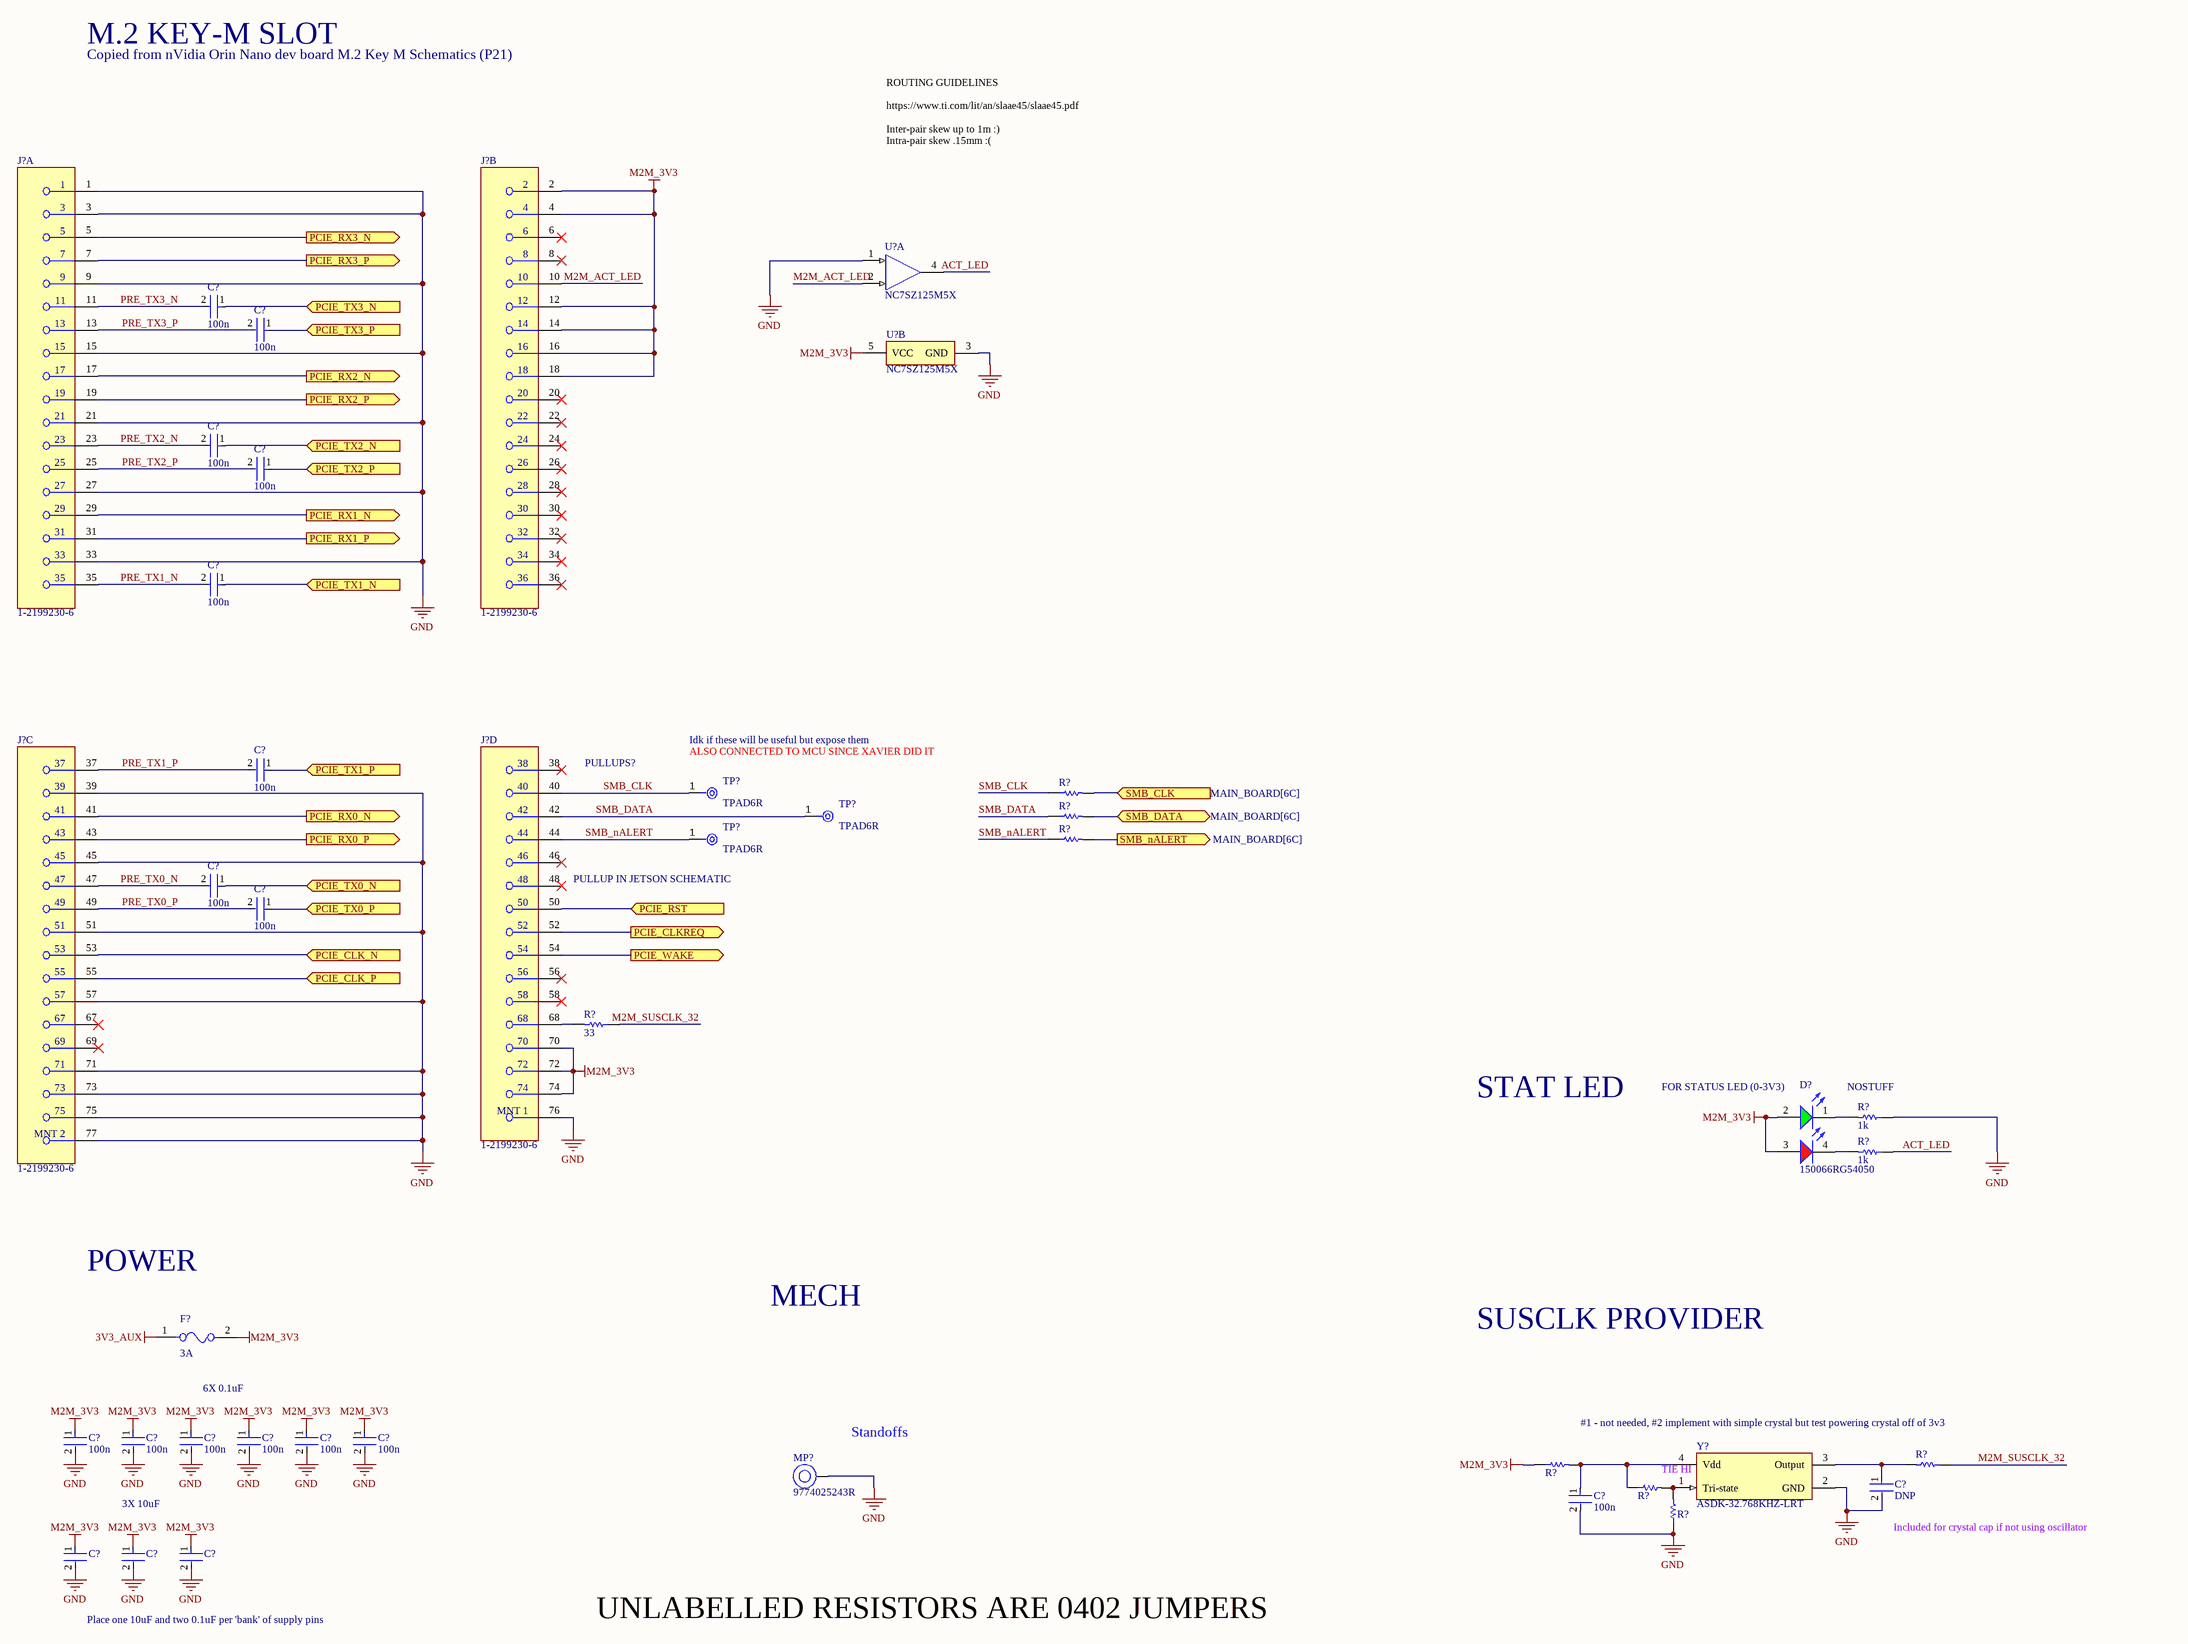
[diagram p10: NVME.SchDoc]

### Parts
(Parts that share a designator on the sheet are numbered #1, #2 ... from top to bottom, then left to right.)
C?#37  100n  [FP-0402-L_1_0_0_05-W_0_5-IPC_A]
C?#38  100n  [FP-0402-L_1_0_0_05-W_0_5-IPC_A]
C?#39  100n  [FP-0402-L_1_0_0_05-W_0_5-IPC_A]
C?#40  100n  [FP-0402-L_1_0_0_05-W_0_5-IPC_A]
C?#41  100n  [FP-0402-L_1_0_0_05-W_0_5-IPC_A]
C?#42  100n  [FP-0402-L_1_0_0_05-W_0_5-IPC_A]
C?#43  100n  [FP-0402-L_1_0_0_05-W_0_5-IPC_A]
C?#44  100n  [FP-0402-L_1_0_0_05-W_0_5-IPC_A]
C?#45  100n  [FP-0402-L_1_0_0_05-W_0_5-IPC_A]
C?#46  100n  [FP-0402-L_1_0_0_05-W_0_5-IPC_A]
C?#47  100n  [FP-0402-L_1_0_0_05-W_0_5-IPC_A]
C?#48  100n  [FP-0402-L_1_0_0_05-W_0_5-IPC_A]
C?#49  100n  [FP-0402-L_1_0_0_05-W_0_5-IPC_A]
C?#50  100n  [FP-0402-L_1_0_0_05-W_0_5-IPC_A]
C?#51  DNP  [FP-0402-L_1_0_0_05-W_0_5-IPC_A]
C?#52  100n  [FP-0402-L_1_0_0_05-W_0_5-IPC_A]
C?#53  GRM188R60J106ME47D  [FP-GRM188-0_1-e0_2_0_55-IPC_A]  (value not drawn)
C?#54  GRM188R60J106ME47D  [FP-GRM188-0_1-e0_2_0_55-IPC_A]  (value not drawn)
C?#55  GRM188R60J106ME47D  [FP-GRM188-0_1-e0_2_0_55-IPC_A]  (value not drawn)
D?#2  150066RG54050  [WL-SBCD_0606]
F?  3A  [FP-SF-1206FP-MFG]
J?#12  1-2199230-6  [FP-1-2199230-6-MFG]  (part A of 4)
J?#13  1-2199230-6  [FP-1-2199230-6-MFG]  (part B of 4)
J?#14  1-2199230-6  [FP-1-2199230-6-MFG]  (part C of 4)
J?#15  1-2199230-6  [FP-1-2199230-6-MFG]  (part D of 4)
MP?#3  9774025243R  [9774025243]
R?#27  0402 JUMPER  [RESC1005X40X25ML05T05]  (value not drawn)
R?#28  0402 JUMPER  [RESC1005X40X25ML05T05]  (value not drawn)
R?#29  0402 JUMPER  [RESC1005X40X25ML05T05]  (value not drawn)
R?#30  33  [R0603B]
R?#31  1k  [R0603B]
R?#32  1k  [R0603B]
R?#33  0402 JUMPER  [RESC1005X40X25ML05T05]  (value not drawn)
R?#34  0402 JUMPER  [RESC1005X40X25ML05T05]  (value not drawn)
R?#35  0402 JUMPER  [RESC1005X40X25ML05T05]  (value not drawn)
R?#36  DNP  [RESC1005X40X25ML05T05]  (value not drawn)
TP?#1  TPAD6R  [New footprint 1]
TP?#2  TPAD6R  [New footprint 1]
TP?#3  TPAD6R  [New footprint 1]
U?#4  NC7SZ125M5X  [FAIR-SOT23-5_V]  (part A of 2)
U?#5  NC7SZ125M5X  [FAIR-SOT23-5_V]  (part B of 2)
Y?  ASDK-32.768KHZ-LRT  [FP-ASDK-MFG]

### Ports
PCIE_CLK_N (in), PCIE_CLK_P (in), PCIE_CLKREQ (out), PCIE_RST (in), PCIE_RX0_N (out), PCIE_RX0_P (out), PCIE_RX1_N (out), PCIE_RX1_P (out), PCIE_RX2_N (out), PCIE_RX2_P (out), PCIE_RX3_N (out), PCIE_RX3_P (out), PCIE_TX0_N (in), PCIE_TX0_P (in), PCIE_TX1_N (in), PCIE_TX1_P (in), PCIE_TX2_N (in), PCIE_TX2_P (in), PCIE_TX3_N (in), PCIE_TX3_P (in), PCIE_WAKE (out), SMB_CLK (in, see MAIN_BOARD[6C]), SMB_DATA (bidir, see MAIN_BOARD[6C]), SMB_nALERT (out, see MAIN_BOARD[6C])

### Nets
3V3_AUX: F?.1  [project net RAIL]
GND: C?#45.2 C?#46.2 C?#47.2 C?#48.2 C?#49.2 C?#50.2 C?#51.2 C?#52.2 C?#53.2 C?#54.2 C?#55.2 J?#12.1 J?#12.3 J?#12.9 J?#12.15 J?#12.21 J?#12.27 J?#12.33 J?#14.39 J?#14.45 J?#14.51 J?#14.57 J?#14.71 J?#14.73 J?#14.75 J?#14.77(MNT_2) J?#15.76(MNT_1) MP?#3.1 R?#31.1 R?#36.1 U?#4.1(~{OE}) U?#5.3(GND) Y?.2(GND)
M2M_3V3: C?#45.1 C?#46.1 C?#47.1 C?#48.1 C?#49.1 C?#50.1 C?#53.1 C?#54.1 C?#55.1 D?#2.2(A) D?#2.3(A) F?.2 J?#13.2 J?#13.4 J?#13.12 J?#13.14 J?#13.16 J?#13.18 J?#15.70 J?#15.72 J?#15.74 R?#33.1 U?#5.5(VCC)
ACT_LED: R?#32.1 U?#4.4(Y)
M2M_ACT_LED: J?#13.10 U?#4.2(A)
M2M_SUSCLK_32: R?#30.1 R?#35.1
PRE_TX0_N: C?#43.2 J?#14.47
PRE_TX0_P: C?#44.2 J?#14.49
PRE_TX1_N: C?#41.2 J?#12.35
PRE_TX1_P: C?#42.2 J?#14.37
PRE_TX2_N: C?#39.2 J?#12.23
PRE_TX2_P: C?#40.2 J?#12.25
PRE_TX3_N: C?#37.2 J?#12.11
PRE_TX3_P: C?#38.2 J?#12.13
SMB_CLK: J?#15.40 R?#27.1 TP?#1.1(TP)
SMB_DATA: J?#15.42 R?#28.1 TP?#2.1(TP)
SMB_nALERT: J?#15.44 R?#29.1 TP?#3.1(TP)
NetC?#37_1: C?#37.1 ; port PCIE_TX3_N
NetC?#38_1: C?#38.1 ; port PCIE_TX3_P
NetC?#39_1: C?#39.1 ; port PCIE_TX2_N
NetC?#40_1: C?#40.1 ; port PCIE_TX2_P
NetC?#41_1: C?#41.1 ; port PCIE_TX1_N
NetC?#42_1: C?#42.1 ; port PCIE_TX1_P
NetC?#43_1: C?#43.1 ; port PCIE_TX0_N
NetC?#44_1: C?#44.1 ; port PCIE_TX0_P
NetC?#51_1: C?#51.1 R?#35.2 Y?.3(Output)
NetC?#52_1: C?#52.1 R?#33.2 R?#34.1 Y?.4(Vdd)
NetD?#2_1: D?#2.1(K) R?#31.2
NetD?#2_4: D?#2.4(K) R?#32.2
NetJ?#12_5: J?#12.5 ; port PCIE_RX3_N
NetJ?#12_7: J?#12.7 ; port PCIE_RX3_P
NetJ?#12_17: J?#12.17 ; port PCIE_RX2_N
NetJ?#12_19: J?#12.19 ; port PCIE_RX2_P
NetJ?#12_29: J?#12.29 ; port PCIE_RX1_N
NetJ?#12_31: J?#12.31 ; port PCIE_RX1_P
NetJ?#14_41: J?#14.41 ; port PCIE_RX0_N
NetJ?#14_43: J?#14.43 ; port PCIE_RX0_P
NetJ?#14_53: J?#14.53 ; port PCIE_CLK_N
NetJ?#14_55: J?#14.55 ; port PCIE_CLK_P
NetJ?#15_50: J?#15.50 ; port PCIE_RST
NetJ?#15_52: J?#15.52 ; port PCIE_CLKREQ
NetJ?#15_54: J?#15.54 ; port PCIE_WAKE
NetJ?#15_68: J?#15.68 R?#30.2
NetR?#27_2: R?#27.2 ; port SMB_CLK
NetR?#28_2: R?#28.2 ; port SMB_DATA
NetR?#29_2: R?#29.2 ; port SMB_nALERT
NetR?#34_2: R?#34.2 R?#36.2 Y?.1(Tri-state)

Not connected (* = marked no-connect by the designer): J?#13 6* 8* 20* 22* 24* 26* 28* 30* 32* 34* 36*; J?#14 67* 69*; J?#15 38* 46* 48* 56* 58*

### Notes on the sheet
- Copied from nVidia Orin Nano dev board M.2 Key M Schematics (P21)
- M.2 KEY-M SLOT
- ROUTING GUIDELINES
  https://www.ti.com/lit/an/slaae45/slaae45.pdf
  Inter-pair skew up to 1m :)
  Intra-pair skew .15mm :(
- PULLUPS?
- Idk if these will be useful but expose them
- (near TP?#1) ALSO CONNECTED TO MCU SINCE XAVIER DID IT
- PULLUP IN JETSON SCHEMATIC
- STAT LED
- (near D?#2) FOR STATUS LED (0-3V3)
- (near R?#31) NOSTUFF
- POWER
- MECH
- SUSCLK PROVIDER
- (near C?#48) 6X 0.1uF
- #1 - not needed, #2 implement with simple crystal but test powering crystal off of 3v3
- Standoffs
- (near Y?) TIE HI
- (near C?#54) 3X 10uF
- (near C?#51) Included for crystal cap if not using oscillator
- Place one 10uF and two 0.1uF per 'bank' of supply pins
- UNLABELLED RESISTORS ARE 0402 JUMPERS

### Library data of the parts
C?#37-C?#52 = CMP-001-00058-1: as C?#1 on sheet MAIN_BOARD; Min Operating Temperature: -55°C; Mounting Technology: Surface Mount; Pins: 2; Case/Package: 0402; RoHS Compliant: Yes; Max Operating Temperature: 85°C
C?#53-C?#55 = CMP-2006-02792-2: as C?#25 on sheet JETSON_V2; Packaging: Tape and Reel; Voltage Rating (DC): 6.3V; Width: 0.031inch; Termination: SMD/SMT; Dielectric: X5R; Package Quantity: 4000; Voltage Rating: 6.3V; Capacitance: 10uF; Case/Package: 0603; Min Operating Temperature: -55°C; Voltage: 6.3V; Length: 1.6mm; Thickness: 0.035inch; Lead Free: Lead Free; Depth: 0.8mm; Case Code (Imperial): 0603; Max Operating Temperature: 85°C; Material: Ceramic; Height: 0.8mm; Tolerance: 20%; Mount: Surface Mount; REACH SVHC: No SVHC; Radiation Hardening: No; Case Code (Metric): 1608
D?#2 = CMP-004-00040-2: Led, Red/Grn, 180Mcd/230Mcd, 624Nm/525Nm Rohs Compliant: Yes; Source: rgled.SchLib; Component Type: Standard; Pins: 4; Design Item ID: CMP-004-00034-2
F? = CMP-07399-000013-1: FUSE BOARD MOUNT 2A 63VDC 1206; Voltage Rating (DC): 63V; Fuse Type: Board Mount (Cartridge Style Excluded); Approvals: UL; Mount: Surface Mount; Min Operating Temperature: -20°C; Max Operating Temperature: 105°C; Case Code (Imperial): 1206; Packaging: Cut Tape; Current Rating: 2A; RoHS Compliant: Yes; Series: SinglFuse™ SF-1206FP; Case Code (Metric): 3216; Case/Package: 1206
J?#12-J?#15 = CMP-03365-000001-1: CONN EDGE DUAL FMALE 67POS 0.020; Manufacturer: TE; Number Of Contacts: 67; Current Rating: 0.5A; Pitch: 0.5mm; Conn Gender: Female; Is Female: yes; Voltage Rating: 50V; Conn Orientation: Right Angle; Automotive: No; Temperature Range High: +80°C; Package: 1-2199230-6; Category: Conn; Temperature: -40°C to +80°C; Number Of Rows: 2; ComponentLink2URL: http://www.te.com/commerce/DocumentDelivery/DDEController?Action=showdoc&DocId=Specification+Or+Standard%7F114-115006%7FB%7Fpdf%7FEnglish%7FENG_SS_114-115006_B_114-115006_REV_B.pdf%7F1-2199230-6; Manufacturer Part Number: 1-2199230-6; Height: 4.2mm; RoHS: TRUE; Footprint Url: http://www.te.com/commerce/DocumentDelivery/DDEController?Action=showdoc&DocId=Customer+Drawing%7F2199230%7FB2%7Fpdf%7FEnglish%7FENG_CD_2199230_B2.pdf%7F1-2199230-6; Digikey Description: CONN EDGE DUAL FMALE 67POS 0.020; Device Class L2: Card Edge Connectors; Contact Material: Gold,Tin; Device Class L1: Connectors; Device Class L3: unset; ComponentLink2Description: Datasheet; Temperature Range Low: -40°C; Octopart: https://octopart.com/1-2199230-6-te+connectivity-34969376; Lead Free: Yes
MP?#3 = CMP-03913-59774857-1: as MP?#1 on sheet JETSON_V2; REACH SVHC: Unknown; NexarPartId: 59774857; RoHS: Compliant; Material: Steel; Packaging: Tape and Reel; Max Operating Temperature: 150°C; Min Operating Temperature: -55°C; Length: 2.5mm; Height: 2.5mm
R?#27-R?#29 R?#33-R?#36 = CMP-009-00118-2: READ THE NAME; Pins: 2; Component Type: Standard; Design Item ID: CMP-009-00206-2; Source: 0402jump.SchLib
R?#30-R?#32 = CMP-009-00002-14: Resistor
TP?#1-TP?#3 = CMP-00025-2: Test Point .6mm
U?#4 U?#5 = CMP-2000-06816-1: as U?#2 on sheet JETSON_V2; Manufacturer URL: https://www.fairchildsemi.com/; Mounting: SurfaceMount; Number of Channels per Chip: 1; Package Description: 5-Pin Small Outline Transistor, Body 2.9 x 1.6 mm, Pitch 0.95 mm; Package Reference: SOT23-5; Number of Elements per Chip: 1; Package URL: https://www.fairchildsemi.com/package-drawings/MA/MA05B.pdf; Datasheet URL: https://www.fairchildsemi.com/datasheets/NC/NC7SZ125.pdf; Datasheet Version: Rev. 1.0.5, 01/2014; Mounting Technology: SurfaceMount; Operating Temperature: -40to85C; Number of Inputs per Chip: 1
Y? = CMP-27762-001115-1: XTAL OSC XO 32.7680KHZ CMOS SMD; Load Capacitance: 15pF; Max Supply Current: 3.5mA; Min Supply Voltage: 2.97V; Operating Supply Voltage: 3.3V; Frequency Stability: 25ppm; Lead Free: Lead Free; Case/Package: CSMD; Number of Pins: 4; Max Operating Temperature: 85°C; Packaging: Tape and Reel; Width: 0.079inch; Min Operating Temperature: -40°C; Radiation Hardening: No; Length: 2.5mm; Depth: 2mm; Termination: SMD/SMT; Height: 0.037inch; Series: ASDK; Frequency: 32.768kHz; Mount: Surface Mount